# EasyEDA Pro project ProDoc_PCB3_2025-09-22.epro, board PCB3
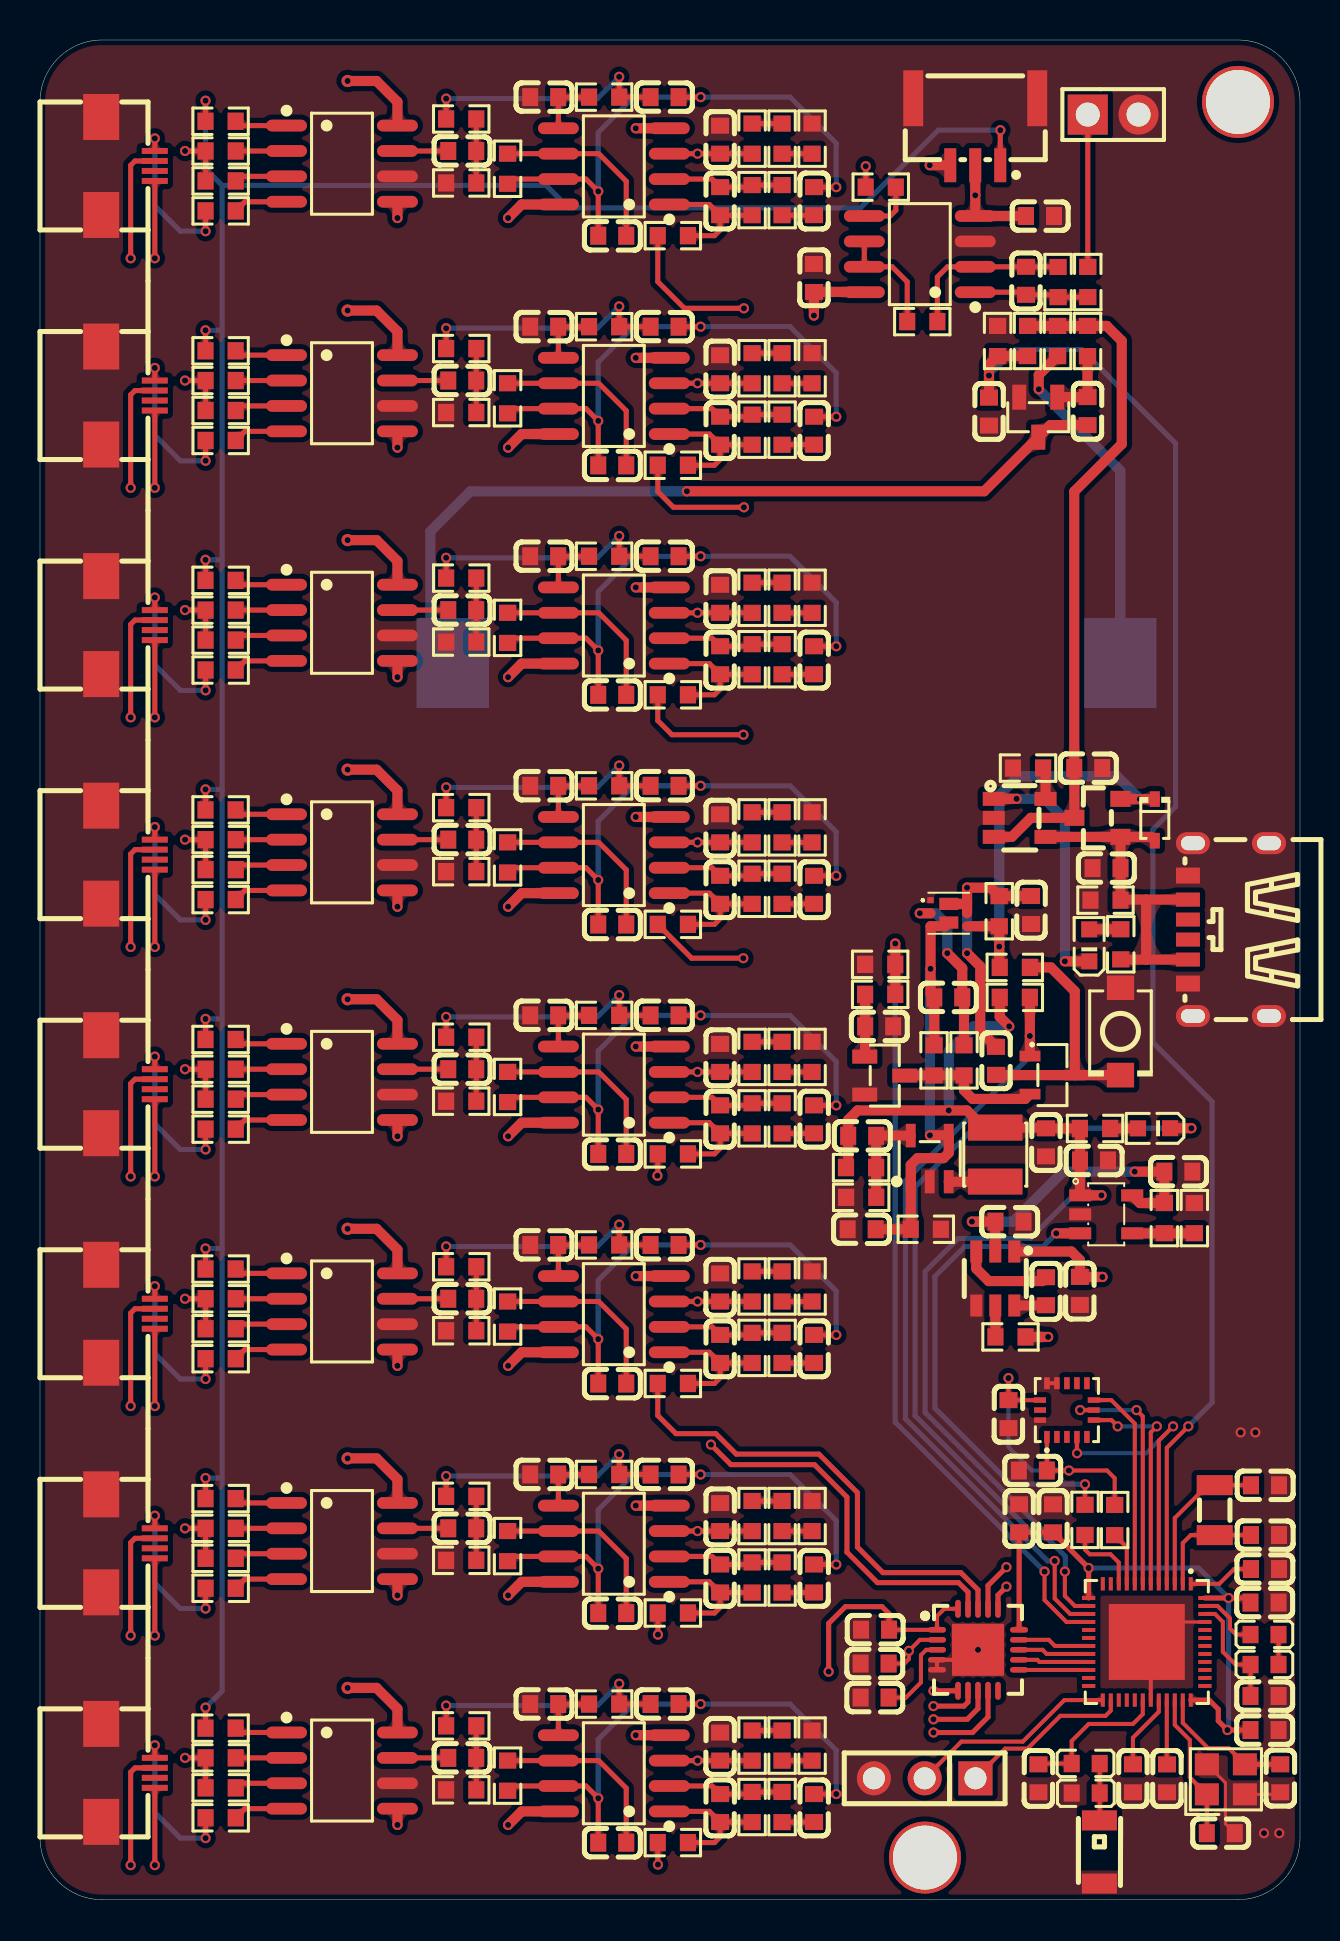
[diagram p0: board, top side]
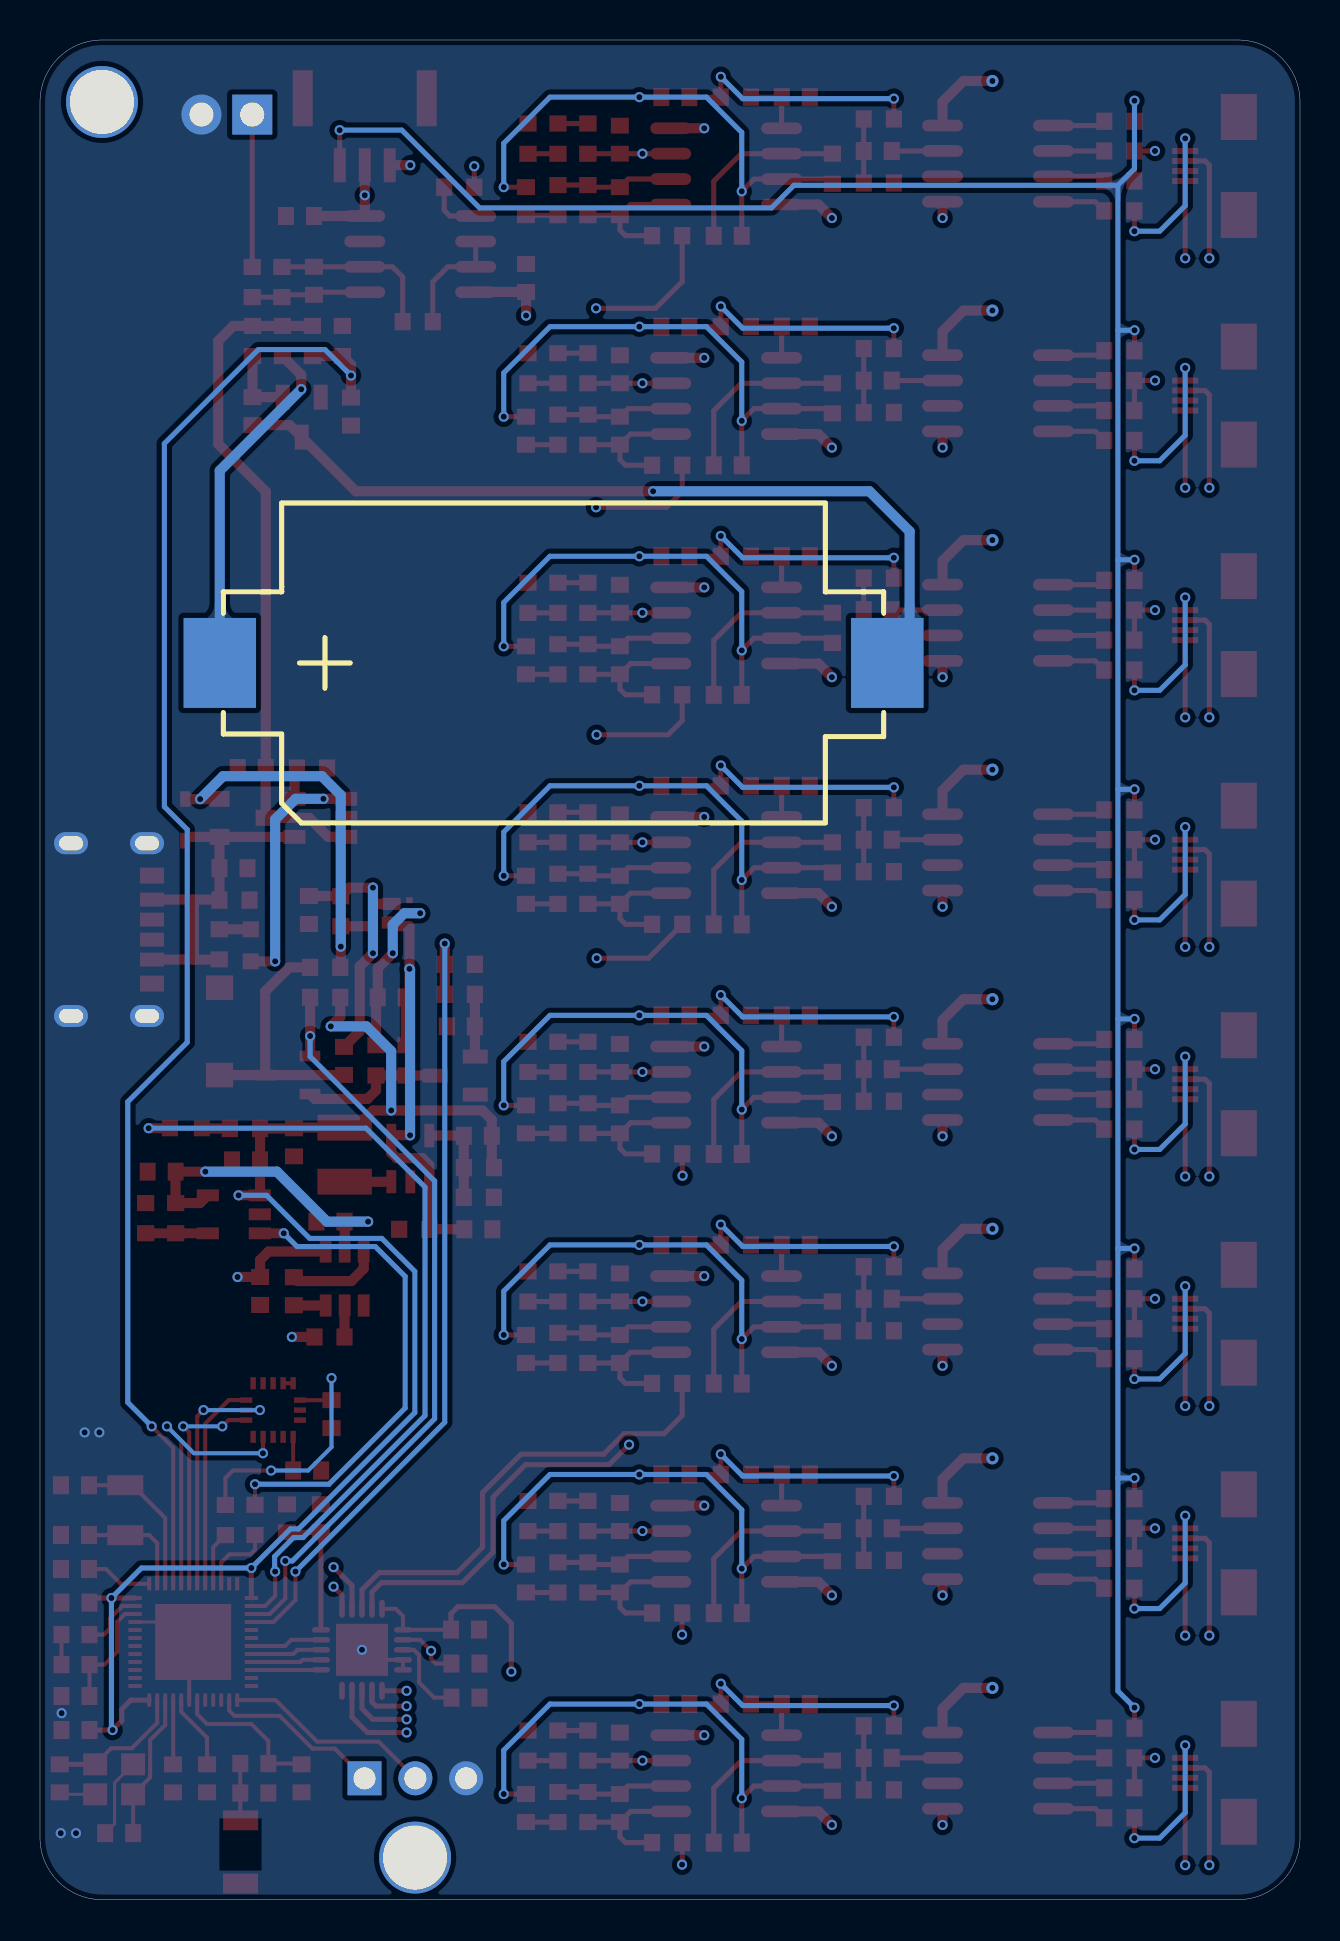
[diagram p1: board, bottom side, seen from below]

Outline 63 x 93 mm; copper layers: Top Layer, Inner1, Inner2, Bottom Layer. Coordinates in mm from the lower left corner of the outline.
Outline path: 0,89.9 0,3.1 arc(0.91,0.91) 3.1,0 59.9,0 arc(62.09,0.91) 63,3.1 63,89.9 arc(62.09,92.09) 59.9,93 3.1,93 arc(0.91,92.09) 0,89.9
Stack: Top Layer 0.035mm 外层铜厚1oz / Dielectric1 0.2104mm 7628 RC49% 8.6mil / Inner1 0.0152mm 内层铜厚 / Dielectric2 1.065mm 1.1mm H/HOZ Copper / Inner2 0.0152mm 内层铜厚 / Dielectric3 0.2104mm 7628 RC49% 8.6mil / Bottom Layer 0.035mm 外层铜厚1oz

## Design rules (mm)
net $1N10277: DP1
net $1N10270: DP1
net $1N10302: DP2
net $1N10299: DP2
template: 自定义配置1
spacing copperThickness1oz (default): track to track 0.102, other pairs 0.152 to 0.3
spacing copperThickness2oz: track to track 0.203, other pairs 0.152 to 0.3
track width copperThickness1oz (default): min 0.127, default 0.254, max 2.54
track width copperThickness2oz: min 0.203, default 0.254, max 2.54
differential pair differentialPair (default): width min 0.127, default 0.254, max 2.54; gap min 0.152, default 0.152
via viaSize (default): diameter min 0.5, default 0.61, max 10; hole min 0.3, default 0.305, max 6.3

## Placement (name value [footprint] x y rotation side)
BT1  BS-24-B4AA016  [BAT-SMD_BS-24-B4AA016]  37.32 61.85 0 bottom
C1  100nF  [C0603]  52.38 74.44 90 top
C2  10UF  [C0603]  47.45 74.42 270 top
C3  4.7UF  [C0603]  41.08 33.53 0 top
C4  NC  [C0603]  41.11 38.2 180 top
C5  22UF  [C0603]  50.3 37.87 90 top
C6  10UF  [C0603]  53.33 51.59 0 top
C7  10UF  [C0603]  52.41 56.59 180 top
C8  4.7UF  [C0603]  48.47 33.91 180 top
C9  4.7UF  [C0603]  51.99 30.44 90 top
C10  4.7UF  [C0603]  50.3 30.43 90 top
C11  1UF  [C0603]  56.92 36.41 180 top
C12  10UF  [C0603]  52.7 36.97 180 top
C13  10UF  [C0603]  41.96 43.67 180 top
C14  10UF  [C0603]  45.41 45.12 180 top
C15  10UF  [C0603]  49.55 49.49 90 top
C16  1UF  [C0603]  47.8 41.95 270 top
C17  4.7UF  [C0603]  48.42 24.28 90 top
C18  100NF  [C0603]  49.64 21.46 0 top
C19  12pF  [C0603]  62.01 6.07 270 top
C20  12pF  [C0603]  59.04 3.33 0 top
C21  0.8pF  [C0603]  49.92 6.07 90 top
C22  100nF  [C0603]  61.25 16.53 0 top
C23  100nF  [C0603]  61.23 14.86 180 top
C24  100nF  [C0603]  61.23 8.48 180 top
C25  100pF  [C0603]  56.35 6.06 90 top
C28  12pF  [C0603]  61.25 18.24 180 top
C29  12pF  [C0603]  61.25 20.72 180 top
C30  NC  [C0603]  54.65 6.07 90 top
C31  1UF  [C0603]  61.23 10.18 180 top
C32  4.7UF  [C0603]  50.65 19.07 90 top
C33  68pF  [C0603]  49.3 80.96 90 top
C34  100NF  [C0603]  50 84.2 180 top
C35  100NF  [C0603]  38.7 81.1 270 top
C36  100NF  [C0603]  41.73 10.11 180 top
C37  10UF  [C0603]  41.73 11.81 180 top
C38  100NF  [C0603]  41.75 13.5 180 top
C39  100NF  [C0603]  48.96 19.07 90 top
C40  1NF  [C0603]  34 84.94 270 top
C41  4.7UF  [C0603]  34 88.01 270 top
C42  10UF  [C0603]  38.7 84.94 270 top
C43  10NF  [C0603]  28.61 83.21 180 top
C44  100NF  [C0603]  25.21 90.14 0 top
C45  100NF  [C0603]  31.23 90.14 0 top
C46  4.7UF  [C0603]  21.11 87.45 0 top
C47  1NF  [C0603]  34 73.46 270 top
C48  4.7UF  [C0603]  34 76.53 270 top
C49  10UF  [C0603]  38.7 73.46 270 top
C50  10NF  [C0603]  28.61 71.73 180 top
C51  100NF  [C0603]  25.21 78.66 0 top
C52  100NF  [C0603]  31.23 78.66 0 top
C53  4.7UF  [C0603]  21.11 75.97 0 top
C54  1NF  [C0603]  34 39.02 270 top
C55  4.7UF  [C0603]  34 42.09 270 top
C56  10UF  [C0603]  38.7 39.02 270 top
C57  10NF  [C0603]  28.61 37.29 180 top
C58  100NF  [C0603]  25.21 44.22 0 top
C59  100NF  [C0603]  31.23 44.22 0 top
C60  4.7UF  [C0603]  21.11 41.53 0 top
C61  1NF  [C0603]  34 27.54 270 top
C62  4.7UF  [C0603]  34 30.61 270 top
C63  10UF  [C0603]  38.7 27.54 270 top
C64  10NF  [C0603]  28.61 25.81 180 top
C65  100NF  [C0603]  25.21 32.74 0 top
C66  100NF  [C0603]  31.23 32.74 0 top
C67  4.7UF  [C0603]  21.11 30.05 0 top
C68  1NF  [C0603]  34 61.98 270 top
C69  4.7UF  [C0603]  34 65.05 270 top
C70  10UF  [C0603]  38.7 61.98 270 top
C71  10NF  [C0603]  28.61 60.25 180 top
C72  100NF  [C0603]  25.21 67.18 0 top
C73  100NF  [C0603]  31.23 67.18 0 top
C74  4.7UF  [C0603]  21.11 64.49 0 top
C75  1NF  [C0603]  34 50.5 270 top
C76  4.7UF  [C0603]  34 53.57 270 top
C77  10UF  [C0603]  38.7 50.5 270 top
C78  10NF  [C0603]  28.61 48.77 180 top
C79  100NF  [C0603]  25.21 55.7 0 top
C80  100NF  [C0603]  31.23 55.7 0 top
C81  4.7UF  [C0603]  21.11 53.01 0 top
C82  1NF  [C0603]  34 16.06 270 top
C83  4.7UF  [C0603]  34 19.13 270 top
C84  10UF  [C0603]  38.7 16.06 270 top
C85  10NF  [C0603]  28.61 14.33 180 top
C86  100NF  [C0603]  25.21 21.26 0 top
C87  100NF  [C0603]  31.23 21.26 0 top
C88  4.7UF  [C0603]  21.11 18.57 0 top
C89  1NF  [C0603]  34 4.58 270 top
C90  4.7UF  [C0603]  34 7.65 270 top
C91  10UF  [C0603]  38.7 4.58 270 top
C92  10NF  [C0603]  28.61 2.85 180 top
C93  100NF  [C0603]  25.21 9.78 0 top
C94  100NF  [C0603]  31.23 9.78 0 top
C95  4.7UF  [C0603]  21.11 7.09 0 top
CN1  WAFER-GH1.25-3PLB  [CONN-SMD_3P-P1.25_XUNPU_WAFER-GH1.25-3PLB]  46.76 88.41 180 top
D1  B5819WS  [SOD-323_L1.7-W1.3-LS2.5-FD]  55.74 54 90 top
FPC2  AFC01-S04FCC-00  [FFC-SMD_4P-P0.50_AFC01-S04FCC-00]  4.4 86.7 270 top
FPC3  AFC01-S04FCC-00  [FFC-SMD_4P-P0.50_AFC01-S04FCC-00]  4.4 75.22 270 top
FPC4  AFC01-S04FCC-00  [FFC-SMD_4P-P0.50_AFC01-S04FCC-00]  4.4 40.78 270 top
FPC5  AFC01-S04FCC-00  [FFC-SMD_4P-P0.50_AFC01-S04FCC-00]  4.4 29.3 270 top
FPC6  AFC01-S04FCC-00  [FFC-SMD_4P-P0.50_AFC01-S04FCC-00]  4.4 63.74 270 top
FPC7  AFC01-S04FCC-00  [FFC-SMD_4P-P0.50_AFC01-S04FCC-00]  4.4 52.26 270 top
FPC8  AFC01-S04FCC-00  [FFC-SMD_4P-P0.50_AFC01-S04FCC-00]  4.4 17.82 270 top
FPC9  AFC01-S04FCC-00  [FFC-SMD_4P-P0.50_AFC01-S04FCC-00]  4.4 6.34 270 top
H1  PZ254V-11-03P  [HDR-TH_3P-P2.54-V-M]  44.23 6.07 180 top
H2  PZ254V-11-02P  [HDR-TH_2P-P2.54-V-M]  53.66 89.27 0 top
L1  2.2uH  [IND-SMD_L3.0-W3.0_FNR30XXS]  47.76 37.26 270 top
L2  10uH  [L0603]  61.23 13.26 0 top
L3  -  [L0603]  61.23 11.76 0 top
L4  3.9nH  [L0603]  52.28 6.81 0 top
L5  NC  [L0603]  52.28 5.33 180 top
LED1  XL-1608UGC-04  [LED0603-RD_GREEN]  52.46 47.72 90 top
LED2  XL-1608UGC-04  [LED0603-RD_GREEN]  55.7 38.58 180 top
NOREF  -  [Pad_e6441]  59.9 89.9 0 top
NOREF#2  -  [Pad_e6444]  44.25 2.1 0 top
Q1  AO3401A  [SOT-23_L2.9-W1.3-P1.90-LS2.4-BR]  52.87 54.1 0 top
Q3  SIA517DJ-T1-GE3  [SIA537EDJT1GE3]  45.44 49.33 270 top
R1  1K  [R0603]  52.38 77.95 270 top
R2  0  [R0603]  50.88 77.95 90 top
R3  470K  [R0603]  49.38 77.95 90 top
R4  470K  [R0603]  47.88 77.95 270 top
R5  330K  [R0603]  44.29 33.53 180 top
R6  453K  [R0603]  41.05 36.61 180 top
R7  100K  [R0603]  41.06 35.12 0 top
R8  20K  [R0603]  49.4 56.59 0 top
R9  1M  [R0603]  53.28 49.98 0 top
R10  20K  [R0603]  48.53 28.14 180 top
R11  470K  [R0603]  56.22 34.08 90 top
R12  160K  [R0603]  57.72 34.08 270 top
R13  2K  [R0603]  54.04 47.78 90 top
R14  2K  [R0603]  52.75 38.57 0 top
R15  10K  [R0603]  42.01 46.77 0 top
R16  1K  [R0603]  42.01 45.27 180 top
R17  300K  [R0603]  46.2 41.97 90 top
R18  100K  [R0603]  44.7 41.97 90 top
R19  10K  [R0603]  48.74 45.12 180 top
R20  100K  [R0603]  47.96 49.43 90 top
R21  10K  [R0603]  48.74 46.62 0 top
R22  100R  [R0603]  53.73 18.98 90 top
R23  2K  [R0603]  52.25 18.99 90 top
R24  470K  [R0603]  52.39 80.9 90 top
R25  470K  [R0603]  50.9 80.9 270 top
R26  10K  [R0603]  44.11 78.92 0 top
R27  0  [R0603]  42.04 85.64 0 top
R28  470K  [R0603]  35.6 84.99 90 top
R29  20K  [R0603]  37.1 84.99 270 top
R30  0  [R0603]  31.64 83.21 0 top
R31  2M  [R0603]  23.38 86.56 90 top
R32  10K  [R0603]  28.21 90.14 0 top
R33  10K  [R0603]  21.06 89.05 0 top
R34  330K  [R0603]  21.06 85.85 180 top
R35  3.3K  [R0603]  9.03 85.95 180 top
R36  3.3K  [R0603]  9.03 87.45 0 top
R38  1K  [R0603]  9.03 88.94 180 top
R39  1K  [R0603]  9.03 84.45 180 top
R40  330K  [R0603]  35.6 88.07 90 top
R41  330K  [R0603]  37.1 88.07 270 top
R42  330K  [R0603]  38.6 88.07 90 top
R43  470K  [R0603]  35.6 73.51 90 top
R44  20K  [R0603]  37.1 73.51 270 top
R45  0  [R0603]  31.64 71.73 0 top
R46  2M  [R0603]  23.38 75.08 90 top
R47  10K  [R0603]  28.21 78.66 0 top
R48  10K  [R0603]  21.06 77.57 0 top
R49  330K  [R0603]  21.06 74.37 180 top
R50  3.3K  [R0603]  9.03 74.47 180 top
R51  3.3K  [R0603]  9.03 75.97 0 top
R52  1K  [R0603]  9.03 77.46 180 top
R53  1K  [R0603]  9.03 72.97 180 top
R54  330K  [R0603]  35.6 76.59 90 top
R55  330K  [R0603]  37.1 76.59 270 top
R56  330K  [R0603]  38.6 76.59 90 top
R57  470K  [R0603]  35.6 39.07 90 top
R58  20K  [R0603]  37.1 39.07 270 top
R59  0  [R0603]  31.64 37.29 0 top
R60  2M  [R0603]  23.38 40.64 90 top
R61  10K  [R0603]  28.21 44.22 0 top
R62  10K  [R0603]  21.06 43.13 0 top
R63  330K  [R0603]  21.06 39.93 180 top
R64  3.3K  [R0603]  9.03 40.03 180 top
R65  3.3K  [R0603]  9.03 41.53 0 top
R66  1K  [R0603]  9.03 43.02 180 top
R67  1K  [R0603]  9.03 38.53 180 top
R68  330K  [R0603]  35.6 42.15 90 top
R69  330K  [R0603]  37.1 42.15 270 top
R70  330K  [R0603]  38.6 42.15 90 top
R71  470K  [R0603]  35.6 27.59 90 top
R72  20K  [R0603]  37.1 27.59 270 top
R73  0  [R0603]  31.64 25.81 0 top
R74  2M  [R0603]  23.38 29.16 90 top
R75  10K  [R0603]  28.21 32.74 0 top
R76  10K  [R0603]  21.06 31.65 0 top
R77  330K  [R0603]  21.06 28.45 180 top
R78  3.3K  [R0603]  9.03 28.55 180 top
R79  3.3K  [R0603]  9.03 30.05 0 top
R80  1K  [R0603]  9.03 31.54 180 top
R81  1K  [R0603]  9.03 27.05 180 top
R82  330K  [R0603]  35.6 30.67 90 top
R83  330K  [R0603]  37.1 30.67 270 top
R84  330K  [R0603]  38.6 30.67 90 top
R85  470K  [R0603]  35.6 62.03 90 top
R86  20K  [R0603]  37.1 62.03 270 top
R87  0  [R0603]  31.64 60.25 0 top
R88  2M  [R0603]  23.38 63.6 90 top
R89  10K  [R0603]  28.21 67.18 0 top
R90  10K  [R0603]  21.06 66.09 0 top
R91  330K  [R0603]  21.06 62.89 180 top
R92  3.3K  [R0603]  9.03 62.99 180 top
R93  3.3K  [R0603]  9.03 64.49 0 top
R94  1K  [R0603]  9.03 65.98 180 top
R95  1K  [R0603]  9.03 61.49 180 top
R96  330K  [R0603]  35.6 65.11 90 top
R97  330K  [R0603]  37.1 65.11 270 top
R98  330K  [R0603]  38.6 65.11 90 top
R99  470K  [R0603]  35.6 50.55 90 top
R100  20K  [R0603]  37.1 50.55 270 top
R101  0  [R0603]  31.64 48.77 0 top
R102  2M  [R0603]  23.38 52.12 90 top
R103  10K  [R0603]  28.21 55.7 0 top
R104  10K  [R0603]  21.06 54.61 0 top
R105  330K  [R0603]  21.06 51.41 180 top
R106  3.3K  [R0603]  9.03 51.51 180 top
R107  3.3K  [R0603]  9.03 53.01 0 top
R108  1K  [R0603]  9.03 54.5 180 top
R109  1K  [R0603]  9.03 50.01 180 top
R110  330K  [R0603]  35.6 53.63 90 top
R111  330K  [R0603]  37.1 53.63 270 top
R112  330K  [R0603]  38.6 53.63 90 top
R113  470K  [R0603]  35.6 16.11 90 top
R114  20K  [R0603]  37.1 16.11 270 top
R115  0  [R0603]  31.64 14.33 0 top
R116  2M  [R0603]  23.38 17.68 90 top
R117  10K  [R0603]  28.21 21.26 0 top
R118  10K  [R0603]  21.06 20.17 0 top
R119  330K  [R0603]  21.06 16.97 180 top
R120  3.3K  [R0603]  9.03 17.07 180 top
R121  3.3K  [R0603]  9.03 18.57 0 top
R122  1K  [R0603]  9.03 20.06 180 top
R123  1K  [R0603]  9.03 15.57 180 top
R124  330K  [R0603]  35.6 19.19 90 top
R125  330K  [R0603]  37.1 19.19 270 top
R126  330K  [R0603]  38.6 19.19 90 top
R127  470K  [R0603]  35.6 4.63 90 top
R128  20K  [R0603]  37.1 4.63 270 top
R129  0  [R0603]  31.64 2.85 0 top
R130  2M  [R0603]  23.38 6.2 90 top
R131  10K  [R0603]  28.21 9.78 0 top
R132  10K  [R0603]  21.06 8.69 0 top
R133  330K  [R0603]  21.06 5.49 180 top
R134  3.3K  [R0603]  9.03 5.59 180 top
R135  3.3K  [R0603]  9.03 7.09 0 top
R136  1K  [R0603]  9.03 8.58 180 top
R137  1K  [R0603]  9.03 4.09 180 top
R138  330K  [R0603]  35.6 7.71 90 top
R139  330K  [R0603]  37.1 7.71 270 top
R140  330K  [R0603]  38.6 7.71 90 top
SW1  TS-1088-AR02016  [SW-SMD_L3.9-W3.0-P4.45]  54.02 43.42 270 top
U1  XB3306A  [SOT-23-3_L2.9-W1.3-P1.90-LS2.4-BR]  49.91 74.14 90 top
U2  RY3408  [SOT-23-5_L3.0-W1.7-P0.95-LS2.8-BL]  44.49 37.06 0 top
U3  TP4054  [TSOT-23-5_L2.9-W1.6-P0.95-LS2.8-BR]  48.98 54.1 180 top
U4  SGM3204YN6G/TR  [SOT-23-6_L2.9-W1.6-P0.95-LS2.8-BR]  47.76 31.06 90 top
U5  SGM2036-ADJYN5G/TR  [SOT-23-5_L3.0-W1.7-P0.95-LS2.8-BR]  53.31 34.27 180 top
U6  SS8050  [SOT-23-3_L2.9-W1.3-P1.90-LS2.4-BR]  42.24 41.21 180 top
U7  BAT54C  [SOT-23-3_L2.9-W1.3-P1.90-LS2.8-BR]  50.62 41.24 180 top
U8  ADXL362BCCZ-RL  [LGA-16_L3.0-W3.0-P0.50-BL]  51.34 24.48 0 top
U9  2.4GHz  [QFN-48_L6.0-W6.0-P0.40-BL-EP3.8]  55.34 12.89 180 top
U10  ANT3216LL00R2400A  [ANT-SMD_L3.2-W1.6]  52.97 2.39 270 top
U11  OP2177ARZ-REEL7  [SOIC-8_L4.9-W3.9-P1.27-LS6.0-BL]  43.99 82.29 90 top
U13  AD7682BCPZ  [LFCSP-20_L4.0-W4.0-P0.50-BL-EP]  46.9 12.49 270 top
U14  INA826AIDR  [SOIC-8_L4.9-W3.9-P1.27-LS6.0-BL]  15.1 86.81 270 top
U15  OP2177ARZ-REEL7  [SOIC-8_L4.9-W3.9-P1.27-LS6.0-BL]  28.69 86.68 90 top
U16  INA826AIDR  [SOIC-8_L4.9-W3.9-P1.27-LS6.0-BL]  15.1 75.34 270 top
U17  OP2177ARZ-REEL7  [SOIC-8_L4.9-W3.9-P1.27-LS6.0-BL]  28.69 75.2 90 top
U18  INA826AIDR  [SOIC-8_L4.9-W3.9-P1.27-LS6.0-BL]  15.1 40.9 270 top
U19  INA826AIDR  [SOIC-8_L4.9-W3.9-P1.27-LS6.0-BL]  15.1 29.42 270 top
U20  OP2177ARZ-REEL7  [SOIC-8_L4.9-W3.9-P1.27-LS6.0-BL]  28.69 40.76 90 top
U21  OP2177ARZ-REEL7  [SOIC-8_L4.9-W3.9-P1.27-LS6.0-BL]  28.69 29.28 90 top
U22  INA826AIDR  [SOIC-8_L4.9-W3.9-P1.27-LS6.0-BL]  15.1 63.86 270 top
U23  INA826AIDR  [SOIC-8_L4.9-W3.9-P1.27-LS6.0-BL]  15.1 52.38 270 top
U24  INA826AIDR  [SOIC-8_L4.9-W3.9-P1.27-LS6.0-BL]  15.1 17.94 270 top
U25  INA826AIDR  [SOIC-8_L4.9-W3.9-P1.27-LS6.0-BL]  15.1 6.46 270 top
U26  OP2177ARZ-REEL7  [SOIC-8_L4.9-W3.9-P1.27-LS6.0-BL]  28.69 63.72 90 top
U27  OP2177ARZ-REEL7  [SOIC-8_L4.9-W3.9-P1.27-LS6.0-BL]  28.69 52.24 90 top
U28  OP2177ARZ-REEL7  [SOIC-8_L4.9-W3.9-P1.27-LS6.0-BL]  28.69 17.8 90 top
U29  OP2177ARZ-REEL7  [SOIC-8_L4.9-W3.9-P1.27-LS6.0-BL]  28.69 6.32 90 top
USB1  TYPE-C 6P(073)  [type-c-smd_type-c-6p_5]  59.42 48.51 90 top
X1  32MHz  [OSC-SMD_4P-L2.5-W2.0-BL]  59.29 6.02 0 top
X2  32.768kHz  [FC-135R_L3.2-W1.5]  58.74 19.48 270 top

## Footprints (pads in the part's own frame, mm; a bottom-side part is the same pattern mirrored in y, then rotated)
ANT-SMD_L3.2-W1.6
  rect 1x1.75 smd: 1(-1.578,0) 2(1.578,0)
BAT-SMD_BS-24-B4AA016
  rect 3.625x4.5 smd: 1(16.688,0) 2(-16.688,0)
C0603
  rect 0.8x0.9 smd: 1(-0.7,0) 2(0.7,0)
CONN-SMD_3P-P1.25_XUNPU_WAFER-GH1.25-3PLB
  rect 0.6x1.7 smd: 1(-1.25,1.675) 2(0.001,1.675) 3(1.25,1.675)
  rect 1x2.8 smd: 4(3.1,-1.675) 5(-3.1,-1.675)
FC-135R_L3.2-W1.5
  rect 1.001x1.801 smd: 1(-1.25,0) 2(1.25,0)
FFC-SMD_4P-P0.50_AFC01-S04FCC-00
  rect 0.3x1.3 smd: 1(-0.75,1.34) 2(-0.25,1.34) 3(0.25,1.34) 4(0.75,1.34)
  rect 2.3x1.8 smd: 5(2.45,-1.34) 6(-2.45,-1.34)
HDR-TH_2P-P2.54-V-M
  rect 2x2 hole 1.2: 1(-1.27,0)
  round 2 hole 1.2: 2(1.27,0)
HDR-TH_3P-P2.54-V-M
  rect 1.7x1.7 hole 1.1: 1(-2.54,0)
  round 1.7 hole 1.1: 2(0,0) 3(2.54,0)
IND-SMD_L3.0-W3.0_FNR30XXS
  rect 1.3x2.72 smd: 1(1.35,0) 2(-1.35,0)
L0603
  rect 0.8x0.864 smd: 1(-0.7,0) 2(0.7,0)
LED0603-RD_GREEN
  rect 0.8x0.8 smd: 1(-0.799,-0.004) 2(0.799,0.004)
LFCSP-20_L4.0-W4.0-P0.50-BL-EP
  oval 0.28x0.9 smd: 1(-1,-2.05) 2(-0.5,-2.05) 3(0,-2.05) 4(0.5,-2.05) 5(1,-2.05) 11(1,2.05) 12(0.5,2.05) 13(0,2.05) 14(-0.5,2.05) 15(-1,2.05)
  oval 0.9x0.28 smd: 6(2.05,-1) 7(2.05,-0.5) 8(2.05,0) 9(2.05,0.5) 10(2.05,1) 16(-2.05,1) 17(-2.05,0.5) 18(-2.05,0) 19(-2.05,-0.5) 20(-2.05,-1)
  rect 2.6x2.6 smd: 21(0,0)
LGA-16_L3.0-W3.0-P0.50-BL
  rect 0.28x0.6 smd: 1(-1,-1.343) 2(-0.5,-1.343) 3(0,-1.343) 4(0.5,-1.343) 5(1,-1.343) 9(1,1.343) 10(0.5,1.343) 11(0,1.343) 12(-0.5,1.343) 13(-1,1.343)
  rect 0.6x0.28 smd: 6(1.343,-0.5) 7(1.343,0) 8(1.343,0.5) 14(-1.343,0.5) 15(-1.343,0) 16(-1.343,-0.5)
OSC-SMD_4P-L2.5-W2.0-BL
  rect 1.2x1.1 smd: 1(-0.95,-0.75) 2(0.95,-0.75) 3(0.95,0.75) 4(-0.95,0.75)
Pad_e6441
  round 3.6 hole 3.2: 1(0,0)
Pad_e6444
  round 3.6 hole 3.2: 1(0,0)
QFN-48_L6.0-W6.0-P0.40-BL-EP3.8
  rect 0.2x0.665 smd: 1(-2.2,-2.908) 2(-1.8,-2.908) 3(-1.4,-2.908) 4(-1,-2.908) 5(-0.6,-2.908) 6(-0.2,-2.908) 7(0.2,-2.908) 8(0.6,-2.908) 9(1,-2.908) 10(1.4,-2.908) 11(1.8,-2.908) 12(2.2,-2.908) 25(2.2,2.908) 26(1.8,2.908) 27(1.4,2.908) 28(1,2.908) 29(0.6,2.908) 30(0.2,2.908) 31(-0.2,2.908) 32(-0.6,2.908) 33(-1,2.908) 34(-1.4,2.908) 35(-1.8,2.908) 36(-2.2,2.908)
  rect 0.665x0.2 smd: 13(2.908,-2.2) 14(2.908,-1.8) 15(2.908,-1.4) 16(2.908,-1) 17(2.908,-0.6) 18(2.908,-0.2) 19(2.908,0.2) 20(2.908,0.6) 21(2.908,1) 22(2.908,1.4) 23(2.908,1.8) 24(2.908,2.2) 37(-2.908,2.2) 38(-2.908,1.8) 39(-2.908,1.4) 40(-2.908,1) 41(-2.908,0.6) 42(-2.908,0.2) 43(-2.908,-0.2) 44(-2.908,-0.6) 45(-2.908,-1) 46(-2.908,-1.4) 47(-2.908,-1.8) 48(-2.908,-2.2)
  rect 3.8x3.8 smd: 49(0,0)
R0603
  rect 0.806x0.864 smd: 1(-0.753,0) 2(0.753,0)
SIA537EDJT1GE3
  rect 0.3x0.325 smd: 1(-0.65,-0.912) 2(0,-0.912) 3(0.65,-0.912) 4(0.65,0.913) 5(0,0.913) 6(-0.65,0.913)
  rect 0.613x0.95 smd: 7(-0.466,0) 8(0.466,0)
SOD-323_L1.7-W1.3-LS2.5-FD
  rect 0.78x0.5 smd: 1(-1.04,0) 2(1.04,0)
SOIC-8_L4.9-W3.9-P1.27-LS6.0-BL
  oval 0.588x2.045 smd: 1(-1.905,-2.772) 2(-0.635,-2.772) 3(0.635,-2.772) 4(1.905,-2.772) 5(1.905,2.772) 6(0.635,2.772) 7(-0.635,2.772) 8(-1.905,2.772)
SOT-23-3_L2.9-W1.3-P1.90-LS2.4-BR
  rect 1.25x0.7 smd: 1(1,-0.95) 2(1,0.95) 3(-1,0)
SOT-23-3_L2.9-W1.3-P1.90-LS2.8-BR
  rect 1.04x0.532 smd: 1(1.12,-0.95) 2(1.12,0.95) 3(-1.12,0)
SOT-23-5_L3.0-W1.7-P0.95-LS2.8-BL
  rect 0.49x1.157 smd: 1(-0.95,-1.153) 2(0,-1.153) 3(0.95,-1.153)
  rect 0.49x1.175 smd: 4(0.95,1.153) 5(-0.95,1.153)
SOT-23-5_L3.0-W1.7-P0.95-LS2.8-BR
  rect 1.1x0.6 smd: 1(1.3,-0.95) 2(1.3,0) 3(1.3,0.95) 4(-1.3,0.95) 5(-1.3,-0.95)
SOT-23-6_L2.9-W1.6-P0.95-LS2.8-BR
  rect 1.1x0.6 smd: 1(1.35,-0.95) 2(1.35,0) 3(1.35,0.95) 4(-1.35,0.95) 5(-1.35,0) 6(-1.35,-0.95)
SOT-23_L2.9-W1.3-P1.90-LS2.4-BR
  rect 1x0.8 smd: 1(1.15,-0.95) 2(1.15,0.95) 3(-1.15,0)
SW-SMD_L3.9-W3.0-P4.45
  rect 1.23x1.36 smd: 1(-2.185,0) 2(2.185,0)
TSOT-23-5_L2.9-W1.6-P0.95-LS2.8-BR
  rect 1.1x0.7 smd: 1(1.294,-0.951) 2(1.294,-0.001) 3(1.294,0.951) 4(-1.294,0.951) 5(-1.294,-0.949)
type-c-smd_type-c-6p_5
  oval 1.1x1.7 hole 0.7x1.2: 7(-4.32,1.775) 7(-4.32,-2.025) 7(4.32,1.775) 7(4.32,-2.025)
  rect 0.7x1.2 smd: A5(-0.5,2.025) A9(1.5,2.025) B5(0.5,2.025) B9(-1.5,2.025)
  rect 0.8x1.2 smd: A12(2.7,2.025) B12(-2.7,2.025)

## Nets
3.3V: C4.2 C5.2 C12.2 C23.2 C24.2 C32.1 C39.1 L1.2 R6.2 R14.1 R19.2 U5.1 U9.13 U9.36 U9.48 U13.15
3.7V: C7.2 Q1.3 R1.1 R2.2 R3.2 U3.3
AVCC: C8.2 C11.2 C34.2 C38.1 CN1.2 FPC2.2 FPC3.2 FPC4.2 FPC5.2 FPC6.2 FPC7.2 FPC8.2 FPC9.2 R10.1 R11.2 U4.2 U5.5 U11.4 U13.1 U13.20 U14.8 U15.4 U16.8 U17.4 U18.8 U19.8 U20.4 U21.4 U22.8 U23.8 U24.8 U25.8 U26.4 U27.4 U28.4 U29.4
AVEE: C9.2 C35.2 CN1.3 FPC2.4 FPC3.4 FPC4.4 FPC5.4 FPC6.4 FPC7.4 FPC8.4 FPC9.4 U4.1 U11.8 U14.5 U15.8 U16.5 U17.8 U18.5 U19.5 U20.8 U21.8 U22.5 U23.5 U24.5 U25.5 U26.8 U27.8 U28.8 U29.8
GND: C2.2 C3.1 C5.1 C6.1 C7.1 C8.1 C9.1 C11.1 C12.1 C13.1 C15.1 C17.1 C18.1 C19.2 C20.2 C21.1 C22.2 C23.1 C24.1 C25.1 C28.1 C29.1 C30.1 C31.1 C32.2 C34.1 C35.1 C36.2 C37.2 C38.2 C39.2 C41.1 C44.1 C48.1 C51.1 C55.1 C58.1 C62.1 C65.1 C69.1 C72.1 C76.1 C79.1 C83.1 C86.1 C90.1 C93.1 CN1.4 CN1.5 FPC2.5 FPC2.6 FPC3.5 FPC3.6 FPC4.5 FPC4.6 FPC5.5 FPC5.6 FPC6.5 FPC6.6 FPC7.5 FPC7.6 FPC8.5 FPC8.6 FPC9.5 FPC9.6 H1.3 H2.2 L5.2 Q3.1 R4.1 R5.1 R7.1 R8.1 R9.1 R12.1 R15.1 R34.2 R42.2 R49.2 R56.2 R63.2 R70.2 R77.2 R84.2 R91.2 R98.2 R105.2 R112.2 R119.2 R126.2 R133.2 R140.2 SW1.1 U1.2 U2.2 U3.2 U4.4 U5.2 U6.2 U8.12 U8.13 U8.16 U9.31 U9.45 U9.49 U10.2 U11.3 U13.4 U13.5 U13.21 U14.6 U16.6 U18.6 U19.6 U22.6 U23.6 U24.6 U25.6 USB1.7 USB1.A12 USB1.B12 X1.2 X1.4
VCC: C3.2 C14.2 Q3.3 Q3.8 R5.2 R18.2 U2.1 U2.4
VIN: D1.2 Q1.2 Q3.4 R20.1 R21.1
ADC-CS: U9.22 U13.11
ADC-IN0: R30.1 U13.9
ADC-IN1: R101.1 U13.6
ADC-IN2: R87.1 U13.7
ADC-IN3: R45.1 U13.8
ADC-IN4: R73.1 U13.18
ADC-IN5: R129.1 U13.16
ADC-IN6: R115.1 U13.17
ADC-IN7: R59.1 U13.19
ADC-MISO: U9.19 U13.14
ADC-MOSI: U9.21 U13.12
ADC-REF: C37.1 C41.2 C48.2 C55.2 C62.2 C69.2 C76.2 C83.2 C90.2 R40.1 R54.1 R68.1 R82.1 R96.1 R110.1 R124.1 R138.1 U13.2 U15.3 U17.3 U20.3 U21.3 U26.3 U27.3 U28.3 U29.3
ADC-SCLK: U9.20 U13.13
ADXL: C17.2 C18.2 R22.2 U8.1 U8.14
AMP-POWER-EN: R23.2 U5.3
AR0: R41.2 R42.1
AR1: R55.2 R56.1
AR2: R97.2 R98.1
AR3: R111.2 R112.1
AR4: R69.2 R70.1
AR5: R83.2 R84.1
AR6: R125.2 R126.1
AR7: R139.2 R140.1
BAT-MON: C2.1 R3.1 R4.2 U9.4
BTN: R19.1 U7.1 U9.15
CHG: LED1.1 U3.1
CS: U8.4 U9.5
IN-N: CN1.1 R38.2 R52.2 R66.2 R80.2 R94.2 R108.2 R122.2 R136.2
IN-P-0: FPC2.1 R39.2
IN-P-1: FPC3.1 R53.2
IN-P-2: FPC6.1 R95.2
IN-P-3: FPC7.1 R109.2
IN-P-4: FPC4.1 R67.2
IN-P-5: FPC5.1 R81.2
IN-P-6: FPC8.1 R123.2
IN-P-7: FPC9.1 R137.2
KILL: R15.2 R16.1 U9.16
LED: LED2.1 U9.14
MISO: U8.6 U9.6
MOSI: U8.7 U9.7
RL: H2.1 R24.2
RL-OUT: R27.1 R35.2 R36.1 R50.2 R51.1 R64.2 R65.1 R78.2 R79.1 R92.2 R93.1 R106.2 R107.1 R120.2 R121.1 R134.2 R135.1
SCL: H1.2 U9.25
SCLK: U8.8 U9.8
SWD: H1.1 U9.26
VUSB-5V: C6.2 D1.1 Q1.1 R9.2 R13.1 U3.4 USB1.A9 USB1.B9
$1N282: BT1.2 C1.1 U1.3
$1N287: C1.2 R1.2 U1.1
$1N460: BT1.1 R2.1
$1N834: L1.1 U2.3
$1N1189: C4.1 R6.1 R7.2 U2.5
$1N1612: R8.2 U3.5
$1N2319: R10.2 U4.5
$1N2572: C10.1 U4.6
$1N2577: C10.2 U4.3
$1N3360: LED1.2 R13.2
$1N3498: LED2.2 R14.2
$1N3592: C13.2 R16.2 U6.1
$1N3916: R17.1 R18.1 U6.3 U7.2
$1N4129: C14.1 Q3.2 R17.2
$1N5843: C15.2 C16.1 Q3.5 Q3.6 Q3.7 R20.2
$1N6146: C16.2 R21.2 SW1.2 U7.3
$1N10253: C21.2 L4.1 U9.30
$1N10270: C20.1 U9.34 X1.1
$1N10273: C25.2 U9.33
$1N10277: C19.1 U9.35 X1.3
$1N10299: C29.2 U9.3 X2.1
$1N10302: C28.2 U9.2 X2.2
$1N10354: C22.1 U9.1
$1N10404: R22.1 U9.9
$1N10447: R23.1 U9.10
$1N10573: L4.2 L5.1 U10.1
$1N10814: C30.2 U9.32
$1N10989: L2.1 U9.47
$1N10993: L2.2 L3.2
$1N11012: C31.2 L3.1 U9.46
$1N11801: C33.2 R25.1 R26.2 U11.2
$1N11807: C33.1 R24.1 R25.2 U11.1
$1N14267: R26.1 U11.6 U11.7
$1N14289: R27.2 U11.5
$1N14783: C36.1 U13.3
$1N42917: R11.1 R12.2 U5.4
$2N8873: R107.2 U23.2
$2N8874: R106.1 U23.3
$2N8876: C80.1 R103.2 R104.1
$2N8877: C77.1 C78.2 C80.2 R102.1 U27.7
$2N8880: C81.2 R104.2 R105.1
$2N8881: C79.2 R103.1 U27.5
$2N8882: R108.1 U23.1
$2N8887: R109.1 U23.4
$2N8889: C81.1 U23.7
$2N8891: C78.1 R102.2 U27.6
$2N8895: R110.2 R111.1
$2N8897: C75.2 R99.1 R101.2 U27.1
$2N8899: C75.1 R99.2 R100.1 U27.2
$2N8908: C77.2 R100.2
$2N8922: R96.2 R97.1
$2N8926: C68.2 R85.1 R87.2 U26.1
$2N8928: C70.2 R86.2
$2N8929: C68.1 R85.2 R86.1 U26.2
$2N8932: C47.2 R43.1 R45.2 U17.1
$2N8941: C49.2 R44.2
$2N8945: R54.2 R55.1
$2N8947: C47.1 R43.2 R44.1 U17.2
$2N8957: C40.2 R28.1 R30.2 U15.1
$2N8965: R40.2 R41.1
$2N8966: C42.2 R29.2
$2N8967: C40.1 R28.2 R29.1 U15.2
$2N8968: R93.2 U22.2
$2N8971: R92.1 U22.3
$2N8972: C74.2 R90.2 R91.1
$2N8973: C71.1 R88.2 U26.6
$2N8974: C72.2 R89.1 U26.5
$2N8976: C74.1 U22.7
$2N8978: C73.1 R89.2 R90.1
$2N8979: C70.1 C71.2 C73.2 R88.1 U26.7
$2N8980: R94.1 U22.1
$2N8981: R95.1 U22.4
$2N8984: R51.2 U16.2
$2N8987: R50.1 U16.3
$2N8988: C49.1 C50.2 C52.2 R46.1 U17.7
$2N8989: C52.1 R47.2 R48.1
$2N8990: C53.2 R48.2 R49.1
$2N8997: C51.2 R47.1 U17.5
$2N8999: C50.1 R46.2 U17.6
$2N9000: R53.1 U16.4
$2N9001: R52.1 U16.1
$2N9004: C53.1 U16.7
$2N9005: C44.2 R32.1 U15.5
$2N9006: C42.1 C43.2 C45.2 R31.1 U15.7
$2N9007: C43.1 R31.2 U15.6
$2N9008: C45.1 R32.2 R33.1
$2N9014: C46.2 R33.2 R34.1
$2N9016: R35.1 U14.3
$2N9017: R36.2 U14.2
$2N9026: R38.1 U14.1
$2N9027: R39.1 U14.4
$2N9029: C46.1 U14.7
$2N9038: C91.2 R128.2
$2N9041: R138.2 R139.1
$2N9047: C89.1 R127.2 R128.1 U29.2
$2N9048: C89.2 R127.1 R129.2 U29.1
$2N9051: C84.1 C85.2 C87.2 R116.1 U28.7
$2N9052: C85.1 R116.2 U28.6
$2N9053: C63.1 C64.2 C66.2 R74.1 U21.7
$2N9056: C64.1 R74.2 U21.6
$2N9060: C66.1 R75.2 R76.1
$2N9061: R82.2 R83.1
$2N9063: C65.2 R75.1 U21.5
$2N9064: C87.1 R117.2 R118.1
$2N9065: C86.2 R117.1 U28.5
$2N9066: C88.2 R118.2 R119.1
$2N9067: C61.2 R71.1 R73.2 U21.1
$2N9069: C61.1 R71.2 R72.1 U21.2
$2N9076: C63.2 R72.2
$2N9083: R135.2 U25.2
$2N9084: R134.1 U25.3
$2N9087: C95.1 U25.7
$2N9089: C94.1 R131.2 R132.1
$2N9090: C91.1 C92.2 C94.2 R130.1 U29.7
$2N9093: C93.2 R131.1 U29.5
$2N9094: C92.1 R130.2 U29.6
$2N9095: R136.1 U25.1
$2N9100: R137.1 U25.4
$2N9101: C95.2 R132.2 R133.1
$2N9102: R121.2 U24.2
$2N9117: R124.2 R125.1
$2N9121: C82.2 R113.1 R115.2 U28.1
$2N9123: C84.2 R114.2
$2N9124: C82.1 R113.2 R114.1 U28.2
$2N9129: C54.1 R57.2 R58.1 U20.2
$2N9135: C56.2 R58.2
$2N9139: C54.2 R57.1 R59.2 U20.1
$2N9141: C67.2 R76.2 R77.1
$2N9143: C88.1 U24.7
$2N9149: R79.2 U19.2
$2N9150: C67.1 U19.7
$2N9151: R81.1 U19.4
$2N9152: R80.1 U19.1
$2N9154: R120.1 U24.3
$2N9155: R123.1 U24.4
$2N9156: R122.1 U24.1
$2N9161: R78.1 U19.3
$2N9168: R65.2 U18.2
$2N9171: R64.1 U18.3
$2N9173: C60.1 U18.7
$2N9175: C56.1 C57.2 C59.2 R60.1 U20.7
$2N9176: R68.2 R69.1
$2N9177: R66.1 U18.1
$2N9178: R67.1 U18.4
$2N9184: C59.1 R61.2 R62.1
$2N9185: C58.2 R61.1 U20.5
$2N9186: C60.2 R62.2 R63.1
$2N9190: C57.1 R60.2 U20.6

Pads without a net: FPC2 3; FPC3 3; FPC4 3; FPC5 3; FPC6 3; FPC7 3; FPC8 3; FPC9 3; NOREF 1; NOREF#2 1; U8 2 3 5 9 10 11 15; U9 11 12 17 18 23 24 27 28 29 37 38 39 40 41 42 43 44; U13 10; USB1 A5 B5

## Via types
v1: diameter 0.508, hole 0.305, Top Layer to Bottom Layer, 187 vias
v2: diameter 0.61, hole 0.305, Top Layer to Bottom Layer, 8 vias

## Routing (per net, layer and track width the routed paths; a pad name or vN(x,y) marks a point on that pad's centre or on a via; arc(x,y) is an arc through that point)
3.3V: length 87.2
  Top Layer w0.254: U9.48 v1(59.43,15.09) 60.3,15.09 C23.2 ; U9.13 v1(52.43,16.59) C32.1 48.96,18.37 C39.1 48.96,13.5 U13.15 ; C24.2 v1(59.37,8.48) 58.91,8.94 58.91,9.52 58.46,9.98 57.54,9.98
  Top Layer w0.508: R6.2 40.41,36.72 C4.2 40.41,39 40.88,39.47 v1(45.44,39.47) 46.34,39.47 47.2,38.61 L1.2 50.26,38.61 C5.2 50.31,38.57 R14.1 52,35.23 U5.1 v1(53.07,35.22) ; v1(48.46,43.67) 47.99,44.15 R19.2
  Bottom Layer w0.254: v1(59.37,8.48) 59.43,8.54 v1(59.43,15.09) 57.93,16.59 v1(52.43,16.59) 50.48,18.54 50.07,18.54 44.26,24.36 44.26,31.42 45.91,33.07 49.52,33.07 51.67,35.22 v1(53.07,35.22)
  Bottom Layer w0.508: v1(48.46,43.67) 46.69,43.67 45.44,42.43 v1(45.44,39.47)
3.7V: length 34.3
  Top Layer w0.508: 47.69,53.15 48.59,53.15 49.54,54.1 Q1.3 51.72,56.58 C7.2 51.71,70.42 54.09,72.79 54.09,77.95 53.34,78.7 R1.1 R2.2 R3.2
AVCC: length 127.7
  Top Layer w0.203: C38.1 42.46,13.49 U13.1 44.85,14.18 45.22,14.54 U13.20
  Top Layer w0.254: v1(4.53,47.65) 4.53,52.29 4.75,52.51 FPC7.2 ; FPC3.2 4.75,75.47 4.53,75.25 v1(4.53,70.61) ; v1(4.53,1.72) 4.53,6.37 4.75,6.59 FPC9.2 ; FPC6.2 4.75,63.99 4.53,63.77 v1(4.53,59.12) ; v1(39.43,11.4) 39.43,13.82 40.27,14.65 42.1,14.65 42.45,14.3 C38.1 ; v1(4.53,36.17) 4.53,40.81 4.75,41.03 FPC4.2 ; FPC2.2 4.75,86.95 4.53,86.73 v1(4.53,82.09) ; FPC5.2 4.75,29.55 4.53,29.33 v1(4.53,24.69) ; v1(4.53,13.21) 4.53,17.85 4.75,18.07 FPC8.2
  Top Layer w0.508: U4.2 47.76,33.9 47.77,33.91 v1(46.59,33.91) ; CN1.2 v1(46.76,85.23) 46.76,84.2 C34.2 ; U22.8 17.87,66.94 16.83,67.99 v2(15.38,67.99) ; U26.4 v1(29.79,65.62) ; v2(15.38,10.59) 16.83,10.59 17.87,9.54 U25.8 ; U23.8 17.87,55.46 16.83,56.51 v2(15.38,56.51) ; U28.4 v1(29.79,19.7) ; 49.28,28.14 v1(50.41,28.14) ; v2(15.38,79.47) 16.83,79.47 17.87,78.42 U16.8 ; v2(15.38,90.95) 16.83,90.95 17.87,89.9 U14.8 ; U21.4 v1(29.79,31.18) ; U15.4 v1(29.79,88.58) ; U17.4 v1(29.79,77.1) ; U27.4 v1(29.79,54.14) ; U29.4 v1(29.79,8.22) ; U18.8 17.87,43.98 16.83,45.03 v2(15.38,45.03) ; v1(54.73,36.41) C11.2 R11.2 55,34.84 U5.5 ; U19.8 17.87,32.5 16.83,33.55 v2(15.38,33.55) ; U24.8 17.87,21.02 16.83,22.07 v2(15.38,22.07) ; U20.4 v1(29.79,42.66)
  Bottom Layer w0.508: v1(54.73,36.41) 51.15,36.41 48.65,33.91 v1(46.59,33.91)
AVEE: length 70
  Top Layer w0.254: v1(5.74,70.61) FPC3.4 ; v1(5.74,24.69) FPC5.4 ; v1(5.74,59.12) FPC6.4 ; v1(5.74,13.21) FPC8.4 ; v1(5.74,36.17) FPC4.4 ; v1(5.74,47.65) FPC7.4 ; v1(5.74,1.72) FPC9.4 ; v1(5.74,82.09) FPC2.4
  Top Layer w0.508: U14.5 v1(17.87,84.1) ; v1(23.4,38.18) 24.08,38.85 U20.8 ; U16.5 v1(17.87,72.62) ; v1(53.12,31.14) 53.12,31.14 C9.2 51.99,31.99 51.57,32.41 U4.1 ; v1(23.4,61.14) 24.08,61.81 U26.8 ; v1(44.49,86.74) 45.51,86.74 45.51,86.74 ; U17.8 24.08,73.29 v1(23.4,72.62) ; U27.8 24.08,50.33 v1(23.4,49.66) ; U28.8 24.08,15.89 v1(23.4,15.22) ; U18.5 v1(17.87,38.18) ; v1(23.4,26.7) 24.08,27.37 U21.8 ; U29.8 24.08,4.41 v1(23.4,3.74) ; U11.8 41.2,80.4 C35.2 v1(38.7,79.22) ; U23.5 v1(17.87,49.66) ; U19.5 v1(17.87,26.7) ; U15.8 24.08,84.77 v1(23.4,84.1) ; U25.5 v1(17.87,3.74) ; U24.5 v1(17.87,15.22) ; U22.5 v1(17.87,61.14)
GND: length 14.7
  Top Layer w0.152: X1.4 59.27,5.84 59.27,3.8 C20.2 ; U9.45 56.34,13.89 55.84,13.39 ; C19.2 61.91,5.27 X1.2
  Top Layer w0.203: U8.13 U8.12 ; U9.49 55.54,12.69 55.54,9.98 ; U13.21 46.4,11.99 U13.4 U13.5
  vias: v1(46.9,12.5) v1(60.03,23.37) v1(60.77,23.37) v1(61.2,3.33) v1(61.92,9.33) v1(61.96,3.33)
VCC: length 24.3
  Top Layer w0.508: R18.2 44.71,42.74 C14.2 44.53,45.31 v1(44.53,46.55) 44.53,48.68 45.25,48.68 Q3.8 ; v1(44.5,38.23) 45.42,38.23 U2.4 45.44,37.35 45.17,37.08 43.88,37.08 43.54,36.74 U2.1 R5.2 C3.2
  Bottom Layer w0.508: v1(44.5,38.23) 44.5,46.52 v1(44.53,46.55)
VIN: length 20.9
  Top Layer w0.508: 55.74,55.04 v1(54.99,55.04) 54.03,55.04 54.02,55.05 ; R21.1 47.96,46.65 v1(47.96,47.66) R20.1 47.96,48.68 46.35,48.68
  Bottom Layer w0.508: v1(54.99,55.04) 53.85,56.18 48.91,56.18 47.96,55.24 v1(47.96,47.66)
ADC-CS: length 3.5
  Top Layer w0.203: U9.22 48.96,11.49 U13.11
ADC-IN0: length 91.5
  Top Layer w0.254: R30.1 30.89,80.91 32.22,79.58 v1(35.2,79.58) ; v1(44.67,8.36) 46.63,8.36 47.4,9.13 U13.9
  Inner2 w0.254: v1(35.2,79.58) 36.85,77.93 36.85,17.93 38.97,15.8 44.45,15.8 46.21,14.04 46.21,9.29 45.28,8.36 v1(44.67,8.36)
ADC-IN1: length 50
  Top Layer w0.254: R101.1 32.58,47.08 v1(35.16,47.08) ; U13.6 v1(44.67,10.44)
  Inner2 w0.254: v1(35.16,47.08) 35.16,17.49 38.27,14.38 43.7,14.38 44.18,13.89 44.18,10.93 v1(44.67,10.44)
ADC-IN2: length 64.4
  Top Layer w0.254: U13.7 46.4,9.88 46.2,9.68 v1(44.67,9.68) ; v1(35.17,58.26) 31.6,58.26 30.89,58.96 R87.1
  Inner2 w0.254: v1(44.67,9.68) 45.2,10.21 45.2,13.55 43.92,14.83 38.5,14.83 35.75,17.58 35.75,57.68 v1(35.17,58.26)
ADC-IN3: length 78.1
  Top Layer w0.254: v1(35.2,69.63) 31.67,69.63 30.89,70.41 R45.1 ; v1(44.67,9.02) 46.36,9.02 46.9,9.56 U13.8
  Inner2 w0.254: v1(35.2,69.63) 36.32,68.51 36.32,17.73 38.75,15.3 44.15,15.3 45.71,13.74 45.71,9.68 45.05,9.02 v1(44.67,9.02)
ADC-IN4: length 23.8
  Top Layer w0.254: R73.1 30.89,24.21 31.8,23.3 33.79,23.3 34.82,22.28 38.95,22.28 40.87,20.35 40.87,17.63 42.15,16.35 46.04,16.35 46.9,15.5 U13.18
ADC-IN5: length 31.6
  Top Layer w0.254: v1(48.32,15.65) 47.9,15.23 U13.16 ; v1(30.9,1.75) 30.89,1.76 R129.1
  Inner1 w0.254: v1(48.32,15.65) 48.32,9.15 46.8,7.63 40.1,7.63 38.8,6.33 38.8,2.48 38.07,1.75 v1(30.9,1.75)
ADC-IN6: length 22.4
  Top Layer w0.254: v1(48.32,16.63) 47.4,15.71 U13.17 ; R115.1 30.9,14.33 v1(30.9,13.25)
  Inner1 w0.254: v1(48.32,16.63) 46.35,14.65 39.45,14.65 38.05,13.25 v1(30.9,13.25)
ADC-IN7: length 34
  Top Layer w0.254: v1(33.55,22.75) 34.55,21.75 38.72,21.75 40.35,20.13 40.35,17.38 41.87,15.85 45.93,15.85 46.4,15.38 U13.19 ; v1(30.87,36.2) 30.89,36.22 R59.1
  Inner2 w0.254: v1(30.87,36.2) 32.15,34.93 32.15,29.03 33.55,27.63 v1(33.55,22.75)
ADC-MISO: length 3.6
  Top Layer w0.203: U9.19 50.75,12.69 50.44,12.99 U13.14
ADC-MOSI: length 3.5
  Top Layer w0.203: U13.12 49.86,11.99 49.97,11.89 U9.21
ADC-REF: length 137.3
  Top Layer w0.203: C37.1 43.21,11.81 43.45,12.04 v1(43.45,12.44) 44,12.99 U13.2
  Top Layer w0.254: U20.3 v1(32.88,41.39) C55.2 35.6,41.39 R68.1 ; R124.1 35.6,18.43 C83.2 v1(32.88,18.43) U28.3 ; R40.1 35.6,87.31 C41.2 v1(32.88,87.31) U15.3 ; U21.3 v1(32.88,29.91) C62.2 35.6,29.91 R82.1 ; U29.3 v1(32.88,6.95) 35.6,6.95 R138.1 ; R96.1 35.6,64.35 C69.2 v1(32.88,64.35) 31.46,64.35 ; R110.1 35.6,52.87 C76.2 v1(32.88,52.87) 31.46,52.87 ; R54.1 35.6,75.83 C48.2 v1(32.88,75.83) U17.3
  Inner2 w0.254: 34.43,18.43 34.43,29.91 ; 34.43,18.43 v1(32.88,18.43) ; 34.43,18.43 34.43,10.04 ; 34.43,29.91 v1(32.88,29.91) ; 34.43,29.91 34.43,41.39 ; 34.43,41.39 34.43,52.87 ; 34.43,41.39 v1(32.88,41.39) ; 34.43,52.87 v1(32.88,52.87) ; 34.43,52.87 34.43,64.35 ; v1(32.88,75.83) 34.43,75.83 ; 34.43,75.83 34.43,64.35 ; 34.43,75.83 34.43,85.76 v1(32.88,87.31) ; 34.43,64.35 v1(32.88,64.35) ; 34.43,10.04 32.88,8.48 v1(32.88,6.95) ; 34.43,10.04 36.47,10.04 38.88,12.44 v1(43.45,12.44)
ADC-SCLK: length 3.6
  Top Layer w0.203: 52.43,12.29 50.33,12.29 50.13,12.49 U13.13
ADXL: length 16.2
  Top Layer w0.203: v1(48.42,26.08) C17.2 50,24.98 U8.14 ; C18.2 v1(51.45,21.46) 53.35,21.46 53.73,21.08 R22.2 ; U8.1 50.34,21.46
  Bottom Layer w0.203: v1(48.42,26.08) 48.42,22.63 49.59,21.46 v1(51.45,21.46)
AMP-POWER-EN: length 24.9
  Top Layer w0.203: R23.2 v1(52.25,20.78)
  Top Layer w0.508: U5.3 v1(50.81,33.32)
  Bottom Layer w0.254: v1(50.81,33.32) 50.15,32.66 46.24,32.66 44.74,31.16 44.74,24.59 48.55,20.78 v1(52.25,20.78)
AR0: length 1.5
  Top Layer w0.254: R41.2 R42.1
AR1: length 1.5
  Top Layer w0.254: R55.2 R56.1
AR2: length 1.5
  Top Layer w0.254: R97.2 R98.1
AR3: length 1.5
  Top Layer w0.254: R111.2 R112.1
AR4: length 1.5
  Top Layer w0.254: R69.2 R70.1
AR5: length 1.5
  Top Layer w0.254: R83.2 R84.1
AR6: length 1.5
  Top Layer w0.254: R125.2 R126.1
AR7: length 1.5
  Top Layer w0.254: R139.2 R140.1
BAT-MON: length 75.2
  Top Layer w0.203: U9.4 56.34,22.59 v1(57.42,23.67)
  Top Layer w0.508: C2.1 v1(47.45,76.22) 47.45,76.76 R4.2 R3.1
  Bottom Layer w0.254: v1(47.45,76.22) 48.75,77.52 52.08,77.52 56.78,72.82 56.78,54.66 55.64,53.52 55.64,42.87 58.61,39.9 58.61,24.86 v1(57.42,23.67)
BTN: length 39
  Top Layer w0.203: v1(50.74,16.94) 50.74,15.06 51.51,14.29 52.43,14.29
  Top Layer w0.508: U7.1 49.49,42.19 v1(49.49,43.19) R19.1
  Bottom Layer w0.254: v1(49.49,43.19) 49.49,42.16 43.27,35.94 43.27,24.05 50.38,16.94 v1(50.74,16.94)
CHG: length 12.3
  Top Layer w0.508: LED1.1 v1(51.24,46.93) ; 47.69,55.05 v1(48.83,55.05)
  Bottom Layer w0.508: v1(51.24,46.93) 51.24,54.02 50.22,55.05 v1(48.83,55.05)
CS: length 14.4
  Top Layer w0.203: v1(51.85,22.32) 51.84,22.33 U8.4 ; v1(56.65,23.67) 55.94,22.96 55.94,15.79
  Bottom Layer w0.203: v1(56.65,23.67) 55.31,22.32 v1(51.85,22.32)
IN-N: length 137
  Top Layer w0.254: R66.2 v1(8.28,44.05) ; R94.2 v1(8.28,67) ; R108.2 v1(8.28,55.52) ; R38.2 v1(8.28,89.96) ; R122.2 v1(8.28,21.09) ; R52.2 v1(8.28,78.48) ; v1(48.02,88.49) 48.01,88.49 CN1.1 ; R80.2 v1(8.28,32.56) ; R136.2 v1(8.28,9.61)
  Bottom Layer w0.254: v1(8.28,89.96) 8.28,86.56 9.1,85.73 ; v1(8.28,78.48) 9.1,78.48 ; 9.1,78.48 9.1,85.73 ; 9.1,78.48 9.1,67 ; v1(8.28,9.61) 9.1,10.43 9.1,21.09 ; 9.1,85.73 25.3,85.73 26.43,84.61 41.02,84.61 44.91,88.49 v1(48.02,88.49) ; v1(8.28,67) 9.1,67 ; 9.1,67 9.1,55.52 ; 9.1,21.09 9.1,32.56 ; 9.1,21.09 v1(8.28,21.09) ; 9.1,32.56 v1(8.28,32.56) ; 9.1,32.56 9.1,44.05 ; 9.1,44.05 9.1,55.52 ; 9.1,44.05 v1(8.28,44.05) ; 9.1,55.52 v1(8.28,55.52)
IN-P-0: length 8.1
  Top Layer w0.254: R39.2 v1(8.28,83.44) ; FPC2.1 v1(5.74,88.08)
  Bottom Layer w0.254: v1(8.28,83.44) 7.02,83.44 5.74,84.71 v1(5.74,88.08)
IN-P-1: length 8.1
  Top Layer w0.254: FPC3.1 v1(5.74,76.6) ; R53.2 v1(8.28,71.96)
  Bottom Layer w0.254: v1(8.28,71.96) 7.02,71.96 5.74,73.23 v1(5.74,76.6)
IN-P-2: length 8.1
  Top Layer w0.254: FPC6.1 v1(5.74,65.12) ; R95.2 v1(8.28,60.48)
  Bottom Layer w0.254: v1(5.74,65.12) 5.74,61.75 7.02,60.48 v1(8.28,60.48)
IN-P-3: length 8.1
  Top Layer w0.254: R109.2 v1(8.28,49) ; FPC7.1 v1(5.74,53.64)
  Bottom Layer w0.254: v1(5.74,53.64) 5.74,50.27 7.02,49 v1(8.28,49)
IN-P-4: length 8.1
  Top Layer w0.254: FPC4.1 v1(5.74,42.16) ; R67.2 v1(8.28,37.52)
  Bottom Layer w0.254: v1(8.28,37.52) 7.02,37.52 5.74,38.79 v1(5.74,42.16)
IN-P-5: length 8.1
  Top Layer w0.254: FPC5.1 v1(5.74,30.68) ; R81.2 v1(8.28,26.04)
  Bottom Layer w0.254: v1(5.74,30.68) 5.74,27.31 7.02,26.04 v1(8.28,26.04)
IN-P-6: length 8.1
  Top Layer w0.254: FPC8.1 v1(5.74,19.2) ; R123.2 v1(8.28,14.56)
  Bottom Layer w0.254: v1(8.28,14.56) 7.02,14.56 5.74,15.83 v1(5.74,19.2)
IN-P-7: length 8.1
  Top Layer w0.254: FPC9.1 v1(5.74,7.72) ; R137.2 v1(8.28,3.08)
  Bottom Layer w0.254: v1(5.74,7.72) 5.74,4.35 7.02,3.08 v1(8.28,3.08)
KILL: length 41.1
  Top Layer w0.203: v1(50.23,16.41) 50.23,14.98 51.32,13.89 U9.16
  Top Layer w0.508: 42.76,45.27 v1(42.76,47.81)
  Bottom Layer w0.254: v1(42.76,47.81) 42.76,23.87 v1(50.23,16.41)
LED: length 41.3
  Top Layer w0.203: U9.14 51.74,14.69 51.24,15.19 v1(51.24,16.41)
  Top Layer w0.508: LED2.1 v1(57.57,38.58)
  Bottom Layer w0.254: v1(57.57,38.58) 46.69,38.58 43.75,35.63 43.75,24.2 49.85,18.11 50.32,18.11 51.27,17.16 51.27,16.43 v1(51.24,16.41)
MISO: length 11.3
  Top Layer w0.203: v1(53.88,23.67) 53.57,23.98 U8.6 ; 55.54,15.79 55.54,23.37 v1(55.84,23.67)
  Bottom Layer w0.203: v1(53.88,23.67) v1(55.84,23.67)
MOSI: length 12.3
  Top Layer w0.203: v1(54.82,24.48) 55.14,24.17 U9.7 ; v1(52,24.48) U8.7
  Bottom Layer w0.203: v1(54.82,24.48) v1(52,24.48)
RL: length 7.6
  Top Layer w0.254: R24.2 H2.1
RL-OUT: length 152.1
  Top Layer w0.254: v1(7.25,18.57) R121.1 R120.2 ; v1(7.25,53.01) R107.1 R106.2 ; R27.1 v1(41.29,86.69) ; R78.2 R79.1 v1(7.25,30.05) ; R50.2 R51.1 v1(7.25,75.97) ; R134.2 R135.1 v1(7.25,7.09) ; R92.2 R93.1 v1(7.25,64.49) ; R64.2 R65.1 v1(7.25,41.53) ; R35.2 R36.1 v1(7.25,87.45)
  Inner1 w0.254: 9.54,18.57 9.54,30.05 ; 9.54,18.57 v1(7.25,18.57) ; 9.54,18.57 9.54,9.38 v1(7.25,7.09) ; 9.54,30.05 v1(7.25,30.05) ; 9.54,30.05 9.54,41.53 ; 9.54,64.49 9.54,75.97 ; 9.54,64.49 9.54,53.01 ; 9.54,64.49 v1(7.25,64.49) ; 9.54,75.97 v1(7.25,75.97) ; 9.54,75.97 9.54,85.16 ; 9.54,41.53 9.54,53.01 ; 9.54,41.53 v1(7.25,41.53) ; 9.54,53.01 v1(7.25,53.01) ; 9.54,85.16 26.45,85.16 27.75,83.87 32.22,83.87 36.54,88.19 40.12,88.19 41.29,87.02 v1(41.29,86.69) ; 9.54,85.16 v1(7.25,87.45)
SCL: length 10.5
  Top Layer w0.203: U9.25 51.22,9.98 49.14,7.9 46.07,7.9 H1.2
SCLK: length 10.6
  Top Layer w0.203: U8.8 53.56,24.98 54.74,23.81 U9.8
SWD: length 8.7
  Top Layer w0.203: 46.77,6.07 48.26,7.55 49.38,7.55 51.01,9.19 53.28,9.19 53.54,9.46 53.54,9.98
VUSB-5V: length 18.4
  Top Layer w0.508: D1.1 55.55,53.15 Q1.1 ; 55.31,47.01 54.05,47.01 R13.1 ; 55.31,47.01 55.31,50.01 ; 55.31,47.01 USB1.B9 ; 54.03,53.14 C6.2 54.03,49.99 ; 54.03,49.99 54.05,50.01 55.31,50.01 ; 54.03,49.99 R9.2 ; 55.31,50.01 USB1.A9 ; U3.4 54.02,53.15
$1N282: length 42.1
  Top Layer w0.508: v1(32.35,70.43) 47.21,70.43 U1.3 50.52,73.74 C1.1
  Bottom Layer w0.508: v1(32.35,70.43) 21.53,70.43 19.52,68.43 19.52,62.97 BT1.2
$1N287: length 3.6
  Top Layer w0.508: U1.1 50.87,75.14 C1.2 R1.2
$1N460: length 17.4
  Top Layer w0.508: v1(49.94,75.53) 49.94,76.25 R2.1
  Bottom Layer w0.508: v1(49.94,75.53) 54.01,71.46 BT1.1
$1N834: length 2.3
  Top Layer w0.508: L1.1 47.76,35.9 U2.3
$1N1189: length 4.8
  Top Layer w0.508: U2.5 41.82,38.21 41.81,38.2 41.81,35.13 R7.2
$1N1612: length 1.6
  Top Layer w0.508: R8.2 50.28,56.47 U3.5
$1N2319: length 1.6
  Top Layer w0.508: U4.5 47.77,29.7 R10.2
$1N2572: length 1.6
  Top Layer w0.508: C10.1 50.29,29.71 U4.6
$1N2577: length 4.7
  Top Layer w0.508: U4.3 46.81,31.56 47.43,30.94 50.11,30.94 C10.2
$1N3360: length 1.6
  Top Layer w0.508: LED1.2 52.46,48.53 R13.2
$1N3498: length 1.4
  Top Layer w0.508: R14.2 54.9,38.57 LED2.2
$1N3592: length 3.1
  Top Layer w0.508: R16.2 41.26,42.18 U6.1
$1N3916: length 7.3
  Top Layer w0.508: U7.2 49.26,40.04 46.63,40.04 46.2,40.47 R17.1 R18.1 43.25,41.22 U6.3
$1N4129: length 8.5
  Top Layer w0.508: v1(45.36,47.33) 46.11,46.58 46.11,45.12 46.2,45.04 R17.2 ; Q3.2 v1(43.99,49.33)
  Bottom Layer w0.508: v1(43.99,49.33) 44.79,49.33 45.36,48.75 v1(45.36,47.33)
$1N5843: length 14.1
  Top Layer w0.508: C16.1 47.01,43.43 47.01,46.67 v1(46.35,47.33) ; 46.35,49.8 Q3.5 ; 46.35,49.8 45.44,49.8 ; 46.35,49.8 Q3.6 v1(46.35,50.61) 47.54,50.61 R20.2 47.97,50.19 C15.2
  Bottom Layer w0.508: v1(46.35,50.61) v1(46.35,47.33)
$1N6146: length 13.2
  Top Layer w0.508: SW1.2 U7.3 ; U7.3 51.74,45.43 50.54,46.62 R21.2 ; U7.3 47.81,41.24 C16.2
$1N10253: length 7.6
  Top Layer w0.203: U9.30 55.14,9.28 54.65,8.79 52.44,8.79 51.58,7.93 L4.1 49.96,6.81 49.92,6.77
$1N10270: length 7.3
  Top Layer w0.203: C20.1 58.34,3.33 X1.1 58.34,5.27 57.49,6.11 57.49,7.99 56.74,8.74 U9.34
$1N10273: length 3.2
  Top Layer w0.203: U9.33 56.34,6.78 C25.2
$1N10277: length 6.8
  Top Layer w0.203: U9.35 57.14,8.84 58.41,7.57 59.44,7.57 X1.3
  Top Layer w0.254: X1.3 61.99,6.77
$1N10299: length 7.8
  Top Layer w0.203: C29.2 58.74,20.72 X2.1 58.6,20.6 58.25,20.6 56.74,19.08 U9.3
$1N10302: length 5.6
  Top Layer w0.203: C28.2 60.55,18.23 X2.2 57.54,18.23 57.14,17.83 U9.2
$1N10354: length 3.3
  Top Layer w0.203: C22.1 59.7,16.53 58.96,15.79 57.54,15.79
$1N10404: length 2.7
  Top Layer w0.203: R22.1 54.34,17.62 U9.9
$1N10447: length 3.8
  Top Layer w0.203: U9.10 53.94,16.86 53.53,17.27 52.49,17.27 52.25,17.51 R23.1
$1N10573: length 2.8
  Top Layer w0.203: U10.1 52.98,3.98 L5.1 L4.2
$1N10814: length 3.7
  Top Layer w0.203: 55.94,9.98 55.94,9.39 54.65,8.1 54.65,6.77
$1N10989: length 3.2
  Top Layer w0.203: L2.1 59.8,13.26 59.5,13.56 59.5,14.07 58.88,14.69 U9.47
$1N10993: length 1.5
  Top Layer w0.203: L3.2 L2.2
$1N11012: length 5.8
  Top Layer w0.203: 58.25,14.29 58.75,14.29 59.14,13.89 59.14,12.39 59.78,11.76 L3.1 C31.2
$1N11801: length 8.5
  Top Layer w0.254: R25.1 50.89,81.66 C33.2 45.37,81.66 44.87,81.15 R26.2
$1N11807: length 5.7
  Top Layer w0.254: R24.1 52.39,80.14 R25.2 50.79,80.26 C33.1 49.17,80.39 46.76,80.39
$1N14267: length 5.7
  Top Layer w0.254: U11.6 U11.7 42.61,81.66 43.36,80.91 R26.1
$1N14289: length 2.8
  Top Layer w0.254: U11.5 42.5,84.2 42.79,84.48 R27.2
$1N14783: length 4.2
  Top Layer w0.203: U13.3 44.31,12.49 44.05,12.23 44.05,10.86 43.29,10.11 C36.1
$1N42917: length 3.1
  Top Layer w0.508: U5.4 57.71,33.32 R12.2
$2N8873: length 2.5
  Top Layer w0.254: U23.2 R107.2
$2N8874: length 2.6
  Top Layer w0.254: R106.1 10.02,51.74 U23.3
$2N8876: length 12.7
  Top Layer w0.254: R104.1 v1(20.31,55.63) ; v1(28.96,56.72) 28.96,55.7 C80.1
  Bottom Layer w0.254: v1(20.31,55.63) 27.87,55.63 v1(28.96,56.72)
$2N8877: length 28
  Top Layer w0.254: R102.1 23.62,51.6 U27.7 27.3,51.6 v1(27.91,50.99) C78.2 ; C77.1 v1(39.81,51.2) ; C80.2 v1(33.03,55.7)
  Bottom Layer w0.254: v1(39.81,51.2) 39.81,53.39 37.5,55.7 v1(33.03,55.7) 29.68,55.7 27.91,53.94 v1(27.91,50.99)
$2N8880: length 3.2
  Top Layer w0.254: R104.2 R105.1
$2N8881: length 3.1
  Top Layer w0.254: U27.5 25.92,55.69 C79.2 R103.1
$2N8882: length 2.6
  Top Layer w0.254: R108.1 10,54.28 U23.1
$2N8887: length 2.7
  Top Layer w0.254: U23.4 10.24,50.47 R109.1
$2N8889: length 2.5
  Top Layer w0.254: U23.7 C81.1
$2N8891: length 9.2
  Top Layer w0.254: 23.38,52.87 27.93,52.87 29.31,51.5 C78.1
$2N8895: length 1.5
  Top Layer w0.254: 37.1,54.38 35.6,54.38
$2N8897: length 6.8
  Top Layer w0.254: C75.2 34.01,49.8 R99.1 ; C75.2 33.47,50.33 U27.1 ; C75.2 34,49.06 33.72,48.77 R101.2
$2N8899: length 5.8
  Top Layer w0.254: R100.1 R99.2 35.5,51.2 C75.1 33.6,51.6 U27.2
$2N8908: length 1.6
  Top Layer w0.254: C77.2 38.7,49.8 R100.2
$2N8922: length 1.5
  Top Layer w0.254: 37.1,65.86 35.6,65.86
$2N8926: length 6.8
  Top Layer w0.254: C68.2 34.01,61.28 R85.1 ; C68.2 33.47,61.81 U26.1 ; C68.2 34,60.54 33.72,60.25 R87.2
$2N8928: length 1.6
  Top Layer w0.254: R86.2 38.7,61.28 C70.2
$2N8929: length 5.8
  Top Layer w0.254: U26.2 33.6,63.08 C68.1 35.5,62.68 R85.2 R86.1
$2N8932: length 6.8
  Top Layer w0.254: R45.2 33.72,71.73 34,72.02 C47.2 ; R43.1 34.01,72.76 C47.2 ; U17.1 33.47,73.29 C47.2
$2N8941: length 1.6
  Top Layer w0.254: C49.2 38.7,72.76 R44.2
$2N8945: length 1.5
  Top Layer w0.254: 37.1,77.34 35.6,77.34
$2N8947: length 5.8
  Top Layer w0.254: 31.46,74.56 33.6,74.56 C47.1 35.5,74.16 R43.2 R44.1
$2N8957: length 6.8
  Top Layer w0.254: U15.1 33.47,84.77 C40.2 ; R30.2 33.72,83.21 34,83.5 C40.2 ; C40.2 34.01,84.24 R28.1
$2N8965: length 1.5
  Top Layer w0.254: 37.1,88.82 35.6,88.82
$2N8966: length 1.6
  Top Layer w0.254: C42.2 38.7,84.24 R29.2
$2N8967: length 5.8
  Top Layer w0.254: U15.2 33.6,86.04 C40.1 35.5,85.64 R28.2 R29.1
$2N8968: length 2.5
  Top Layer w0.254: U22.2 R93.2
$2N8971: length 2.6
  Top Layer w0.254: R92.1 10.02,63.22 U22.3
$2N8972: length 3.2
  Top Layer w0.254: R90.2 R91.1
$2N8973: length 9.2
  Top Layer w0.254: R88.2 27.93,64.35 29.31,62.98 C71.1
$2N8974: length 3.1
  Top Layer w0.254: R89.1 C72.2 25.92,67.17 U26.5
$2N8976: length 2.5
  Top Layer w0.254: U22.7 C74.1
$2N8978: length 12.7
  Top Layer w0.254: C73.1 28.96,67.18 v1(28.96,68.2) ; R90.1 v1(20.31,67.11)
  Bottom Layer w0.254: v1(28.96,68.2) 27.87,67.11 v1(20.31,67.11)
$2N8979: length 28
  Top Layer w0.254: C70.1 v1(39.81,62.68) ; C71.2 v1(27.91,62.47) 27.3,63.08 U26.7 23.62,63.08 R88.1 ; C73.2 v1(33.03,67.18)
  Bottom Layer w0.254: v1(39.81,62.68) 39.81,64.87 37.5,67.18 v1(33.03,67.18) 29.68,67.18 27.91,65.42 v1(27.91,62.47)
$2N8980: length 2.6
  Top Layer w0.254: R94.1 10,65.76 U22.1
$2N8981: length 2.7
  Top Layer w0.254: R95.1 10.24,61.95 U22.4
$2N8984: length 2.5
  Top Layer w0.254: U16.2 R51.2
$2N8987: length 2.6
  Top Layer w0.254: U16.3 10.02,74.7 R50.1
$2N8988: length 28
  Top Layer w0.254: C50.2 v1(27.91,73.95) 27.3,74.56 23.62,74.56 R46.1 ; C52.2 v1(33.03,78.66) ; C49.1 v1(39.81,74.16)
  Bottom Layer w0.254: v1(39.81,74.16) 39.81,76.35 37.5,78.66 v1(33.03,78.66) 29.68,78.66 27.91,76.9 v1(27.91,73.95)
$2N8989: length 12.7
  Top Layer w0.254: C52.1 28.96,78.66 v1(28.96,79.68) ; R48.1 v1(20.31,78.59)
  Bottom Layer w0.254: v1(28.96,79.68) 27.87,78.59 v1(20.31,78.59)
$2N8990: length 3.2
  Top Layer w0.254: R48.2 R49.1
$2N8997: length 3.1
  Top Layer w0.254: U17.5 25.92,78.65 C51.2 R47.1
$2N8999: length 9.2
  Top Layer w0.254: R46.2 U17.6 27.93,75.83 29.31,74.46 C50.1
$2N9000: length 2.7
  Top Layer w0.254: R53.1 10.24,73.43 U16.4
$2N9001: length 2.6
  Top Layer w0.254: U16.1 10,77.24 R52.1
$2N9004: length 2.5
  Top Layer w0.254: U16.7 C53.1
$2N9005: length 3.1
  Top Layer w0.254: U15.5 25.92,90.13 C44.2 R32.1
$2N9006: length 28
  Top Layer w0.254: C42.1 v1(39.81,85.64) ; C43.2 v1(27.91,85.43) 27.3,86.04 U15.7 23.62,86.04 R31.1 ; C45.2 v1(33.03,90.14)
  Bottom Layer w0.254: v1(39.81,85.64) 39.81,87.83 37.5,90.14 v1(33.03,90.14) 29.68,90.14 27.91,88.38 v1(27.91,85.43)
$2N9007: length 9.2
  Top Layer w0.254: C43.1 29.31,85.94 27.93,87.31 U15.6 R31.2
$2N9008: length 12.7
  Top Layer w0.254: C45.1 28.96,90.14 v1(28.96,91.16) ; R33.1 v1(20.31,90.07)
  Bottom Layer w0.254: v1(28.96,91.16) 27.87,90.07 v1(20.31,90.07)
$2N9014: length 3.2
  Top Layer w0.254: R34.1 R33.2
$2N9016: length 2.6
  Top Layer w0.254: U14.3 10.02,86.18 R35.1
$2N9017: length 2.5
  Top Layer w0.254: U14.2 R36.2
$2N9026: length 2.6
  Top Layer w0.254: R38.1 10,88.72 U14.1
$2N9027: length 2.7
  Top Layer w0.254: U14.4 10.24,84.91 R39.1
$2N9029: length 2.5
  Top Layer w0.254: U14.7 C46.1
$2N9038: length 1.6
  Top Layer w0.254: R128.2 38.7,3.88 C91.2
$2N9041: length 1.5
  Top Layer w0.254: 37.1,8.46 35.6,8.46
$2N9047: length 5.8
  Top Layer w0.254: U29.2 33.6,5.68 C89.1 35.5,5.28 R127.2 R128.1
$2N9048: length 6.8
  Top Layer w0.254: R127.1 34.01,3.88 C89.2 ; C89.2 34,3.14 33.72,2.85 R129.2 ; C89.2 33.47,4.41 U29.1
$2N9051: length 28
  Top Layer w0.254: C84.1 v1(39.81,16.76) ; R116.1 23.62,17.16 U28.7 27.3,17.16 v1(27.91,16.55) C85.2 ; C87.2 v1(33.03,21.26)
  Bottom Layer w0.254: v1(39.81,16.76) 39.81,18.95 37.5,21.26 v1(33.03,21.26) 29.68,21.26 27.91,19.5 v1(27.91,16.55)
$2N9052: length 9.2
  Top Layer w0.254: C85.1 29.31,17.06 27.93,18.43 U28.6 R116.2
$2N9053: length 28
  Top Layer w0.254: R74.1 23.62,28.64 27.3,28.64 v1(27.91,28.03) C64.2 ; C63.1 v1(39.81,28.24) ; C66.2 v1(33.03,32.74)
  Bottom Layer w0.254: v1(27.91,28.03) 27.91,30.98 29.68,32.74 v1(33.03,32.74) 37.5,32.74 39.81,30.43 v1(39.81,28.24)
$2N9056: length 9.2
  Top Layer w0.254: C64.1 29.31,28.54 27.93,29.91 U21.6 R74.2
$2N9060: length 12.7
  Top Layer w0.254: R76.1 v1(20.31,32.67) ; v1(28.96,33.76) 28.96,32.74 C66.1
  Bottom Layer w0.254: v1(20.31,32.67) 27.87,32.67 v1(28.96,33.76)
$2N9061: length 1.5
  Top Layer w0.254: 37.1,31.42 35.6,31.42
$2N9063: length 3.1
  Top Layer w0.254: U21.5 25.92,32.73 C65.2 R75.1
$2N9064: length 12.7
  Top Layer w0.254: R118.1 v1(20.31,21.19) ; v1(28.96,22.28) 28.96,21.26 C87.1
  Bottom Layer w0.254: v1(20.31,21.19) 27.87,21.19 v1(28.96,22.28)
$2N9065: length 3.1
  Top Layer w0.254: U28.5 25.92,21.25 C86.2 R117.1
$2N9066: length 3.2
  Top Layer w0.254: R119.1 R118.2
$2N9067: length 6.8
  Top Layer w0.254: U21.1 33.47,27.37 C61.2 ; C61.2 34.01,26.84 R71.1 ; C61.2 34,26.1 33.72,25.81 R73.2
$2N9069: length 5.8
  Top Layer w0.254: R72.1 R71.2 35.5,28.24 C61.1 33.6,28.64 31.46,28.64
$2N9076: length 1.6
  Top Layer w0.254: R72.2 38.7,26.84 C63.2
$2N9083: length 2.5
  Top Layer w0.254: U25.2 R135.2
$2N9084: length 2.6
  Top Layer w0.254: U25.3 10.02,5.82 R134.1
$2N9087: length 2.5
  Top Layer w0.254: U25.7 C95.1
$2N9089: length 12.7
  Top Layer w0.254: C94.1 28.96,9.78 v1(28.96,10.8) ; R132.1 v1(20.31,9.71)
  Bottom Layer w0.254: v1(20.31,9.71) 27.87,9.71 v1(28.96,10.8)
$2N9090: length 28
  Top Layer w0.254: C91.1 v1(39.81,5.28) ; C92.2 v1(27.91,5.07) 27.3,5.68 U29.7 23.62,5.68 R130.1 ; C94.2 v1(33.03,9.78)
  Bottom Layer w0.254: v1(39.81,5.28) 39.81,7.47 37.5,9.78 v1(33.03,9.78) 29.68,9.78 27.91,8.02 v1(27.91,5.07)
$2N9093: length 3.1
  Top Layer w0.254: U29.5 25.92,9.77 C93.2 R131.1
$2N9094: length 9.2
  Top Layer w0.254: R130.2 U29.6 27.93,6.95 29.31,5.58 C92.1
$2N9095: length 2.6
  Top Layer w0.254: R136.1 10,8.36 U25.1
$2N9100: length 2.7
  Top Layer w0.254: U25.4 10.24,4.55 R137.1
$2N9101: length 3.2
  Top Layer w0.254: R132.2 R133.1
$2N9102: length 2.5
  Top Layer w0.254: U24.2 R121.2
$2N9117: length 1.5
  Top Layer w0.254: 37.1,19.94 35.6,19.94
$2N9121: length 6.8
  Top Layer w0.254: C82.2 34,14.62 33.72,14.33 R115.2 ; C82.2 33.47,15.89 U28.1 ; C82.2 34.01,15.36 R113.1
$2N9123: length 1.6
  Top Layer w0.254: C84.2 38.7,15.36 R114.2
$2N9124: length 5.8
  Top Layer w0.254: R114.1 R113.2 35.5,16.76 C82.1 33.6,17.16 U28.2
$2N9129: length 5.8
  Top Layer w0.254: U20.2 33.6,40.12 C54.1 35.5,39.72 R57.2 R58.1
$2N9135: length 1.6
  Top Layer w0.254: C56.2 38.7,38.32 R58.2
$2N9139: length 6.8
  Top Layer w0.254: U20.1 33.47,38.85 C54.2 ; C54.2 34.01,38.32 R57.1 ; C54.2 34,37.58 33.72,37.29 R59.2
$2N9141: length 3.2
  Top Layer w0.254: R77.1 R76.2
$2N9143: length 2.5
  Top Layer w0.254: U24.7 C88.1
$2N9149: length 2.5
  Top Layer w0.254: U19.2 R79.2
$2N9150: length 2.5
  Top Layer w0.254: U19.7 C67.1
$2N9151: length 2.7
  Top Layer w0.254: R81.1 10.24,27.51 U19.4
$2N9152: length 2.6
  Top Layer w0.254: U19.1 10,31.32 R80.1
$2N9154: length 2.6
  Top Layer w0.254: U24.3 10.02,17.3 R120.1
$2N9155: length 2.7
  Top Layer w0.254: R123.1 10.24,16.03 U24.4
$2N9156: length 2.6
  Top Layer w0.254: U24.1 10,19.84 R122.1
$2N9161: length 2.6
  Top Layer w0.254: U19.3 10.02,28.78 R78.1
$2N9168: length 2.5
  Top Layer w0.254: U18.2 R65.2
$2N9171: length 2.6
  Top Layer w0.254: R64.1 10.02,40.26 U18.3
$2N9173: length 2.5
  Top Layer w0.254: U18.7 C60.1
$2N9175: length 28
  Top Layer w0.254: R60.1 23.62,40.12 U20.7 27.3,40.12 v1(27.91,39.51) C57.2 ; C56.1 v1(39.81,39.72) ; C59.2 v1(33.03,44.22)
  Bottom Layer w0.254: v1(39.81,39.72) 39.81,41.91 37.5,44.22 v1(33.03,44.22) 29.68,44.22 27.91,42.46 v1(27.91,39.51)
$2N9176: length 1.5
  Top Layer w0.254: 37.1,42.9 35.6,42.9
$2N9177: length 2.6
  Top Layer w0.254: R66.1 10,42.8 U18.1
$2N9178: length 2.7
  Top Layer w0.254: U18.4 10.24,38.99 R67.1
$2N9184: length 12.7
  Top Layer w0.254: R62.1 v1(20.31,44.15) ; C59.1 28.96,44.22 v1(28.96,45.24)
  Bottom Layer w0.254: v1(20.31,44.15) 27.87,44.15 v1(28.96,45.24)
